# EAGLE schematic BeagleBone_Black_Wireless (EAGLE 7.4.0)
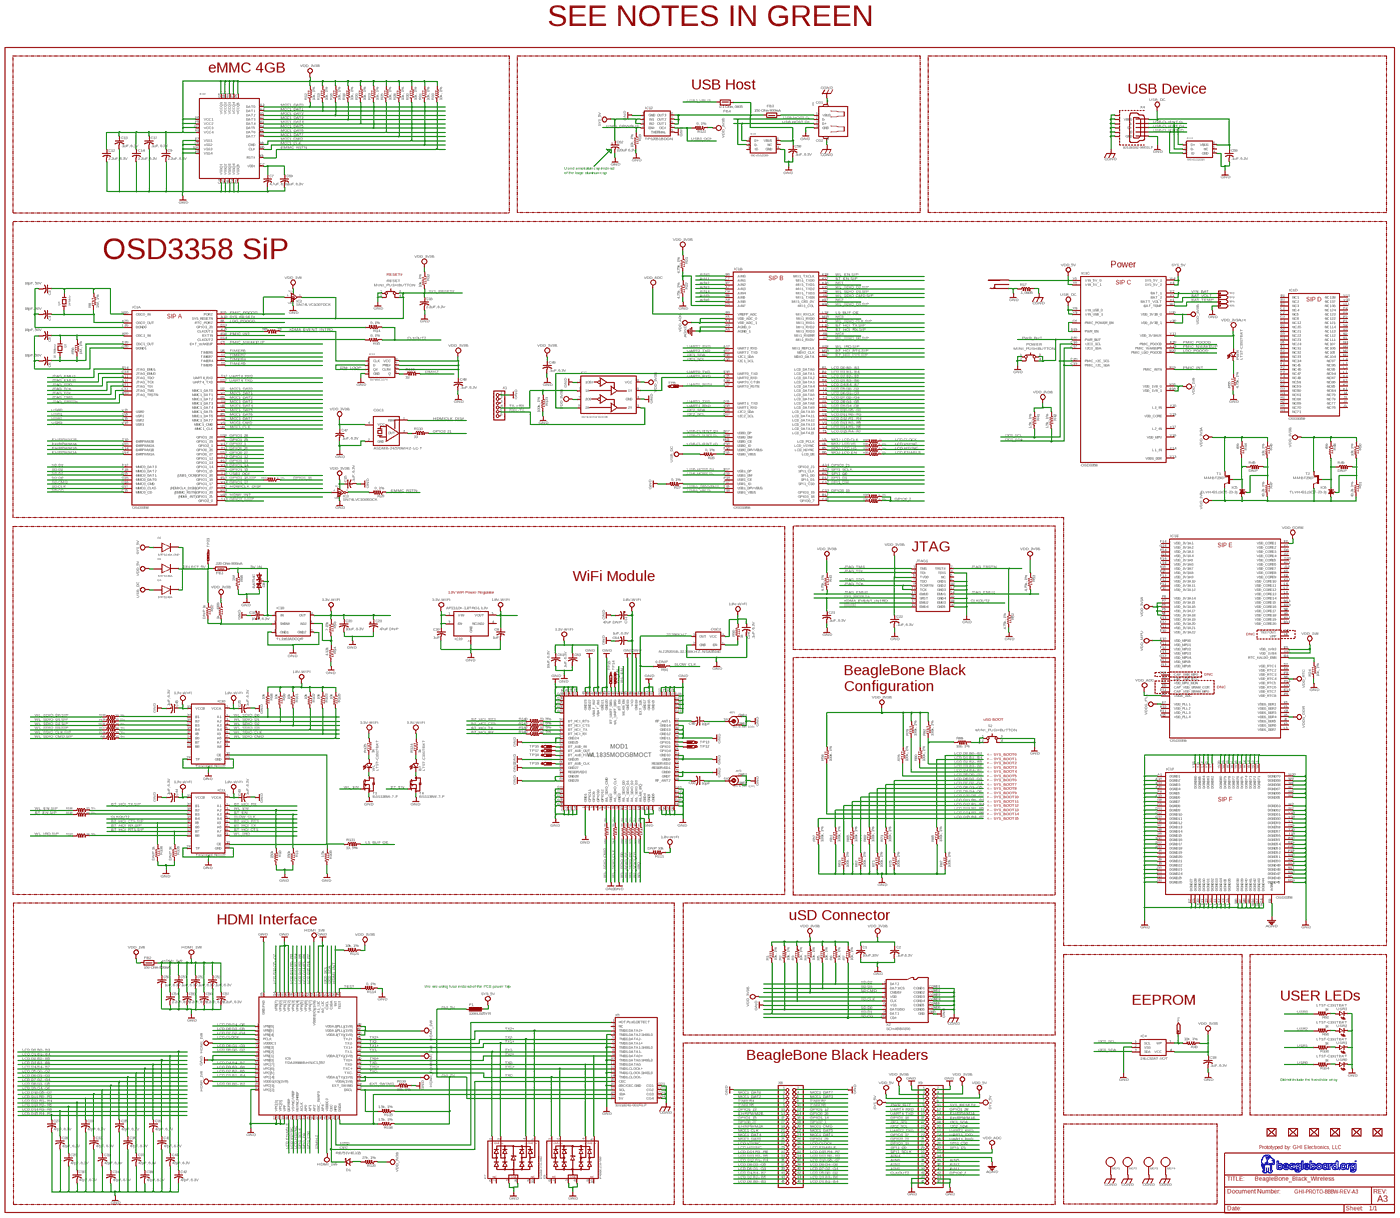
[diagram p0: schematic, sheet 1, overview]
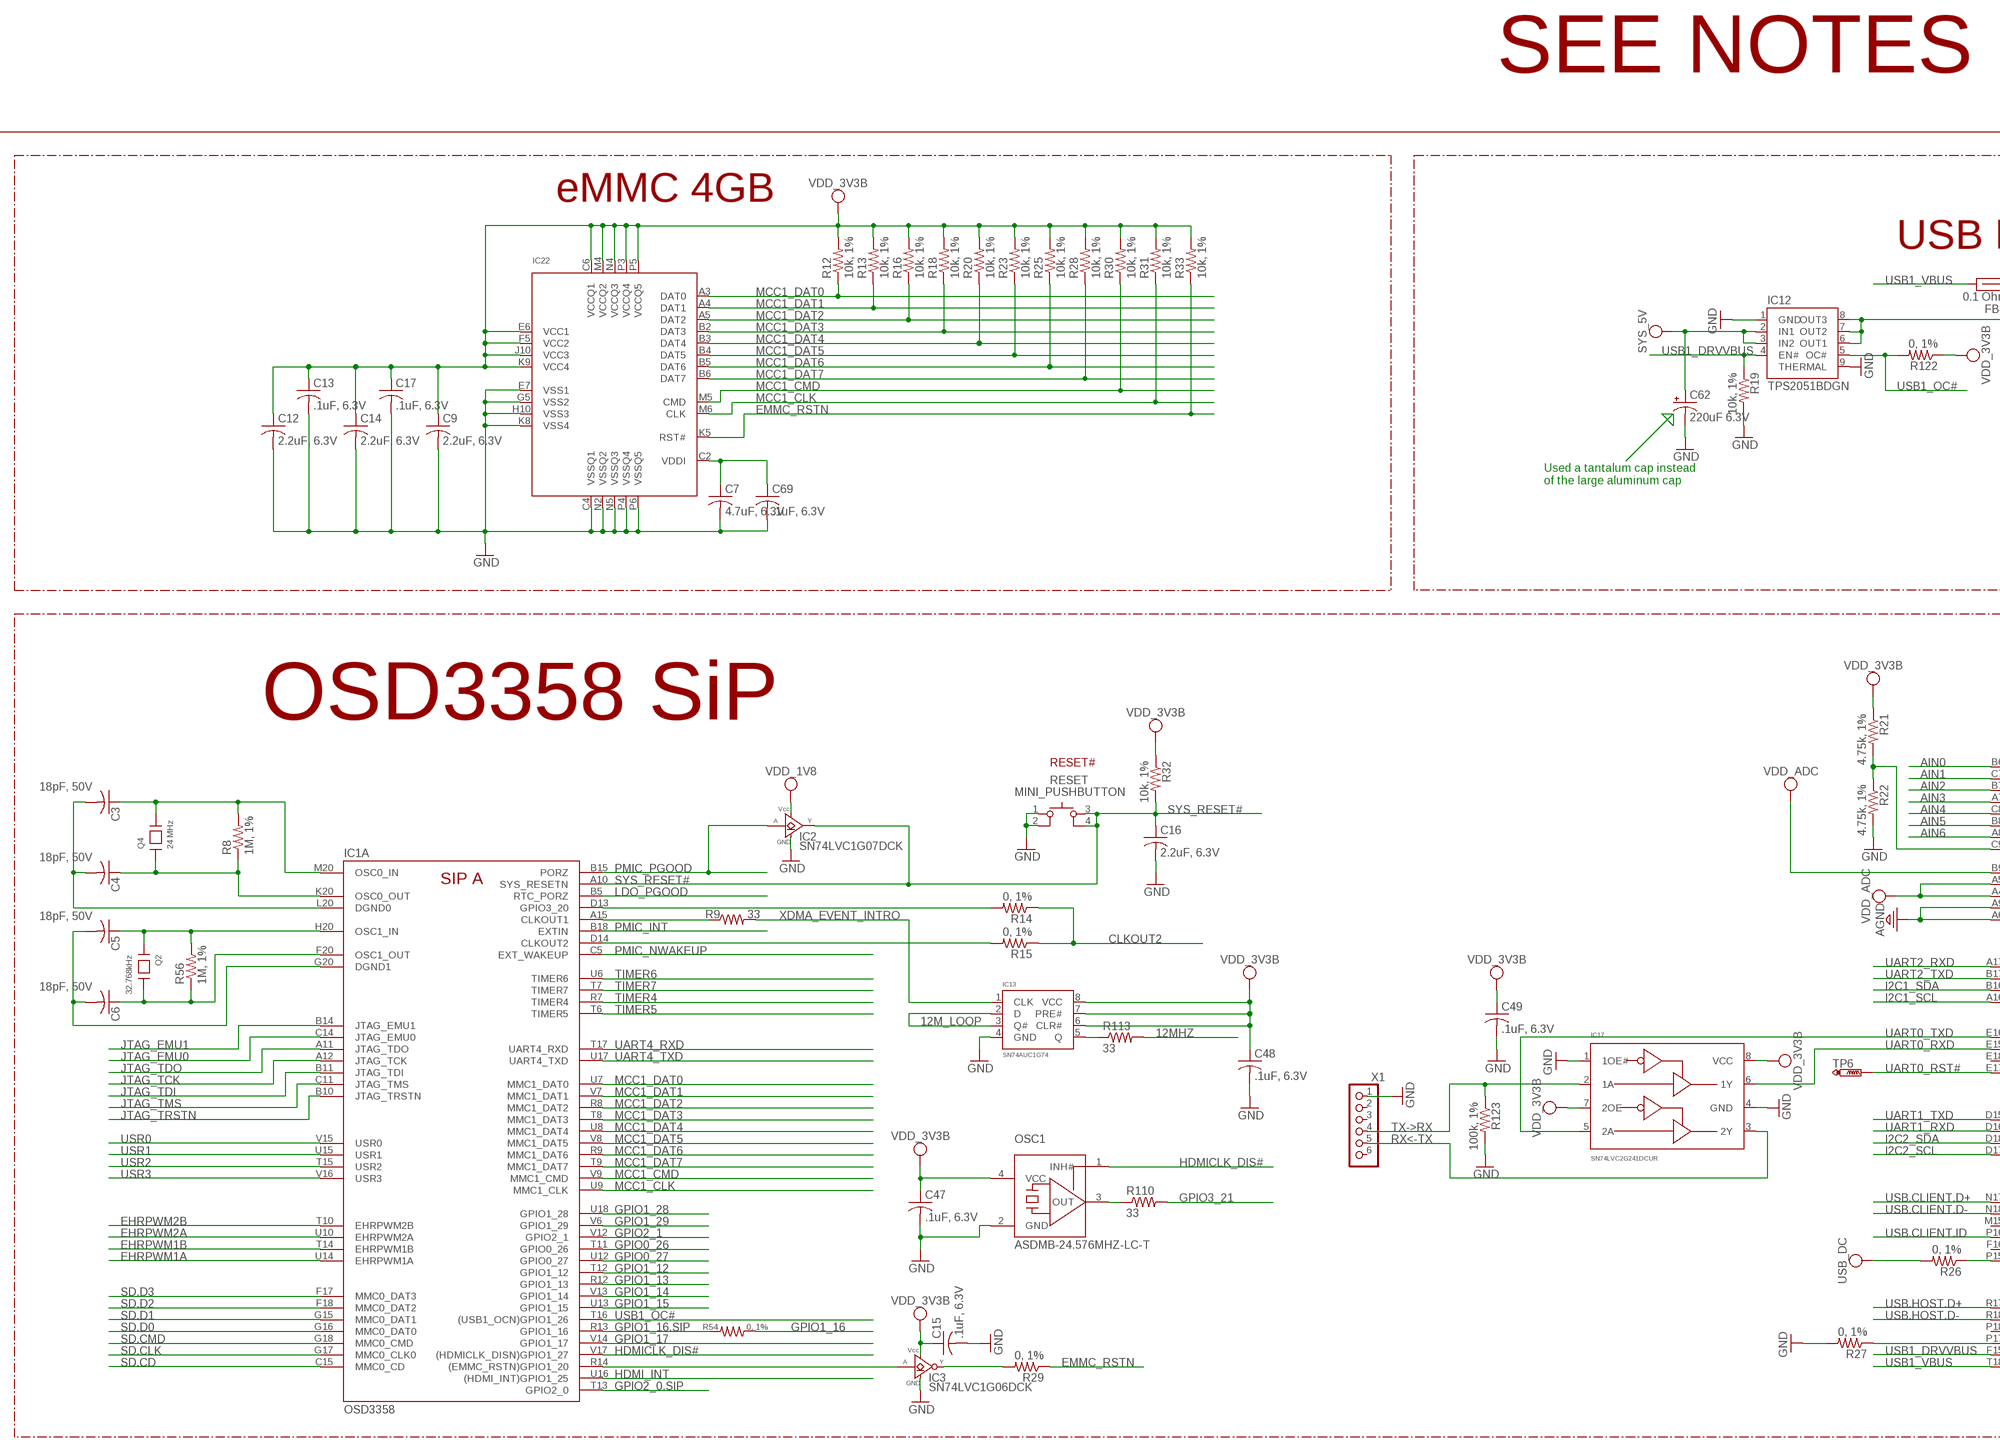
[diagram p1: schematic, sheet 1, part 1 of 4]
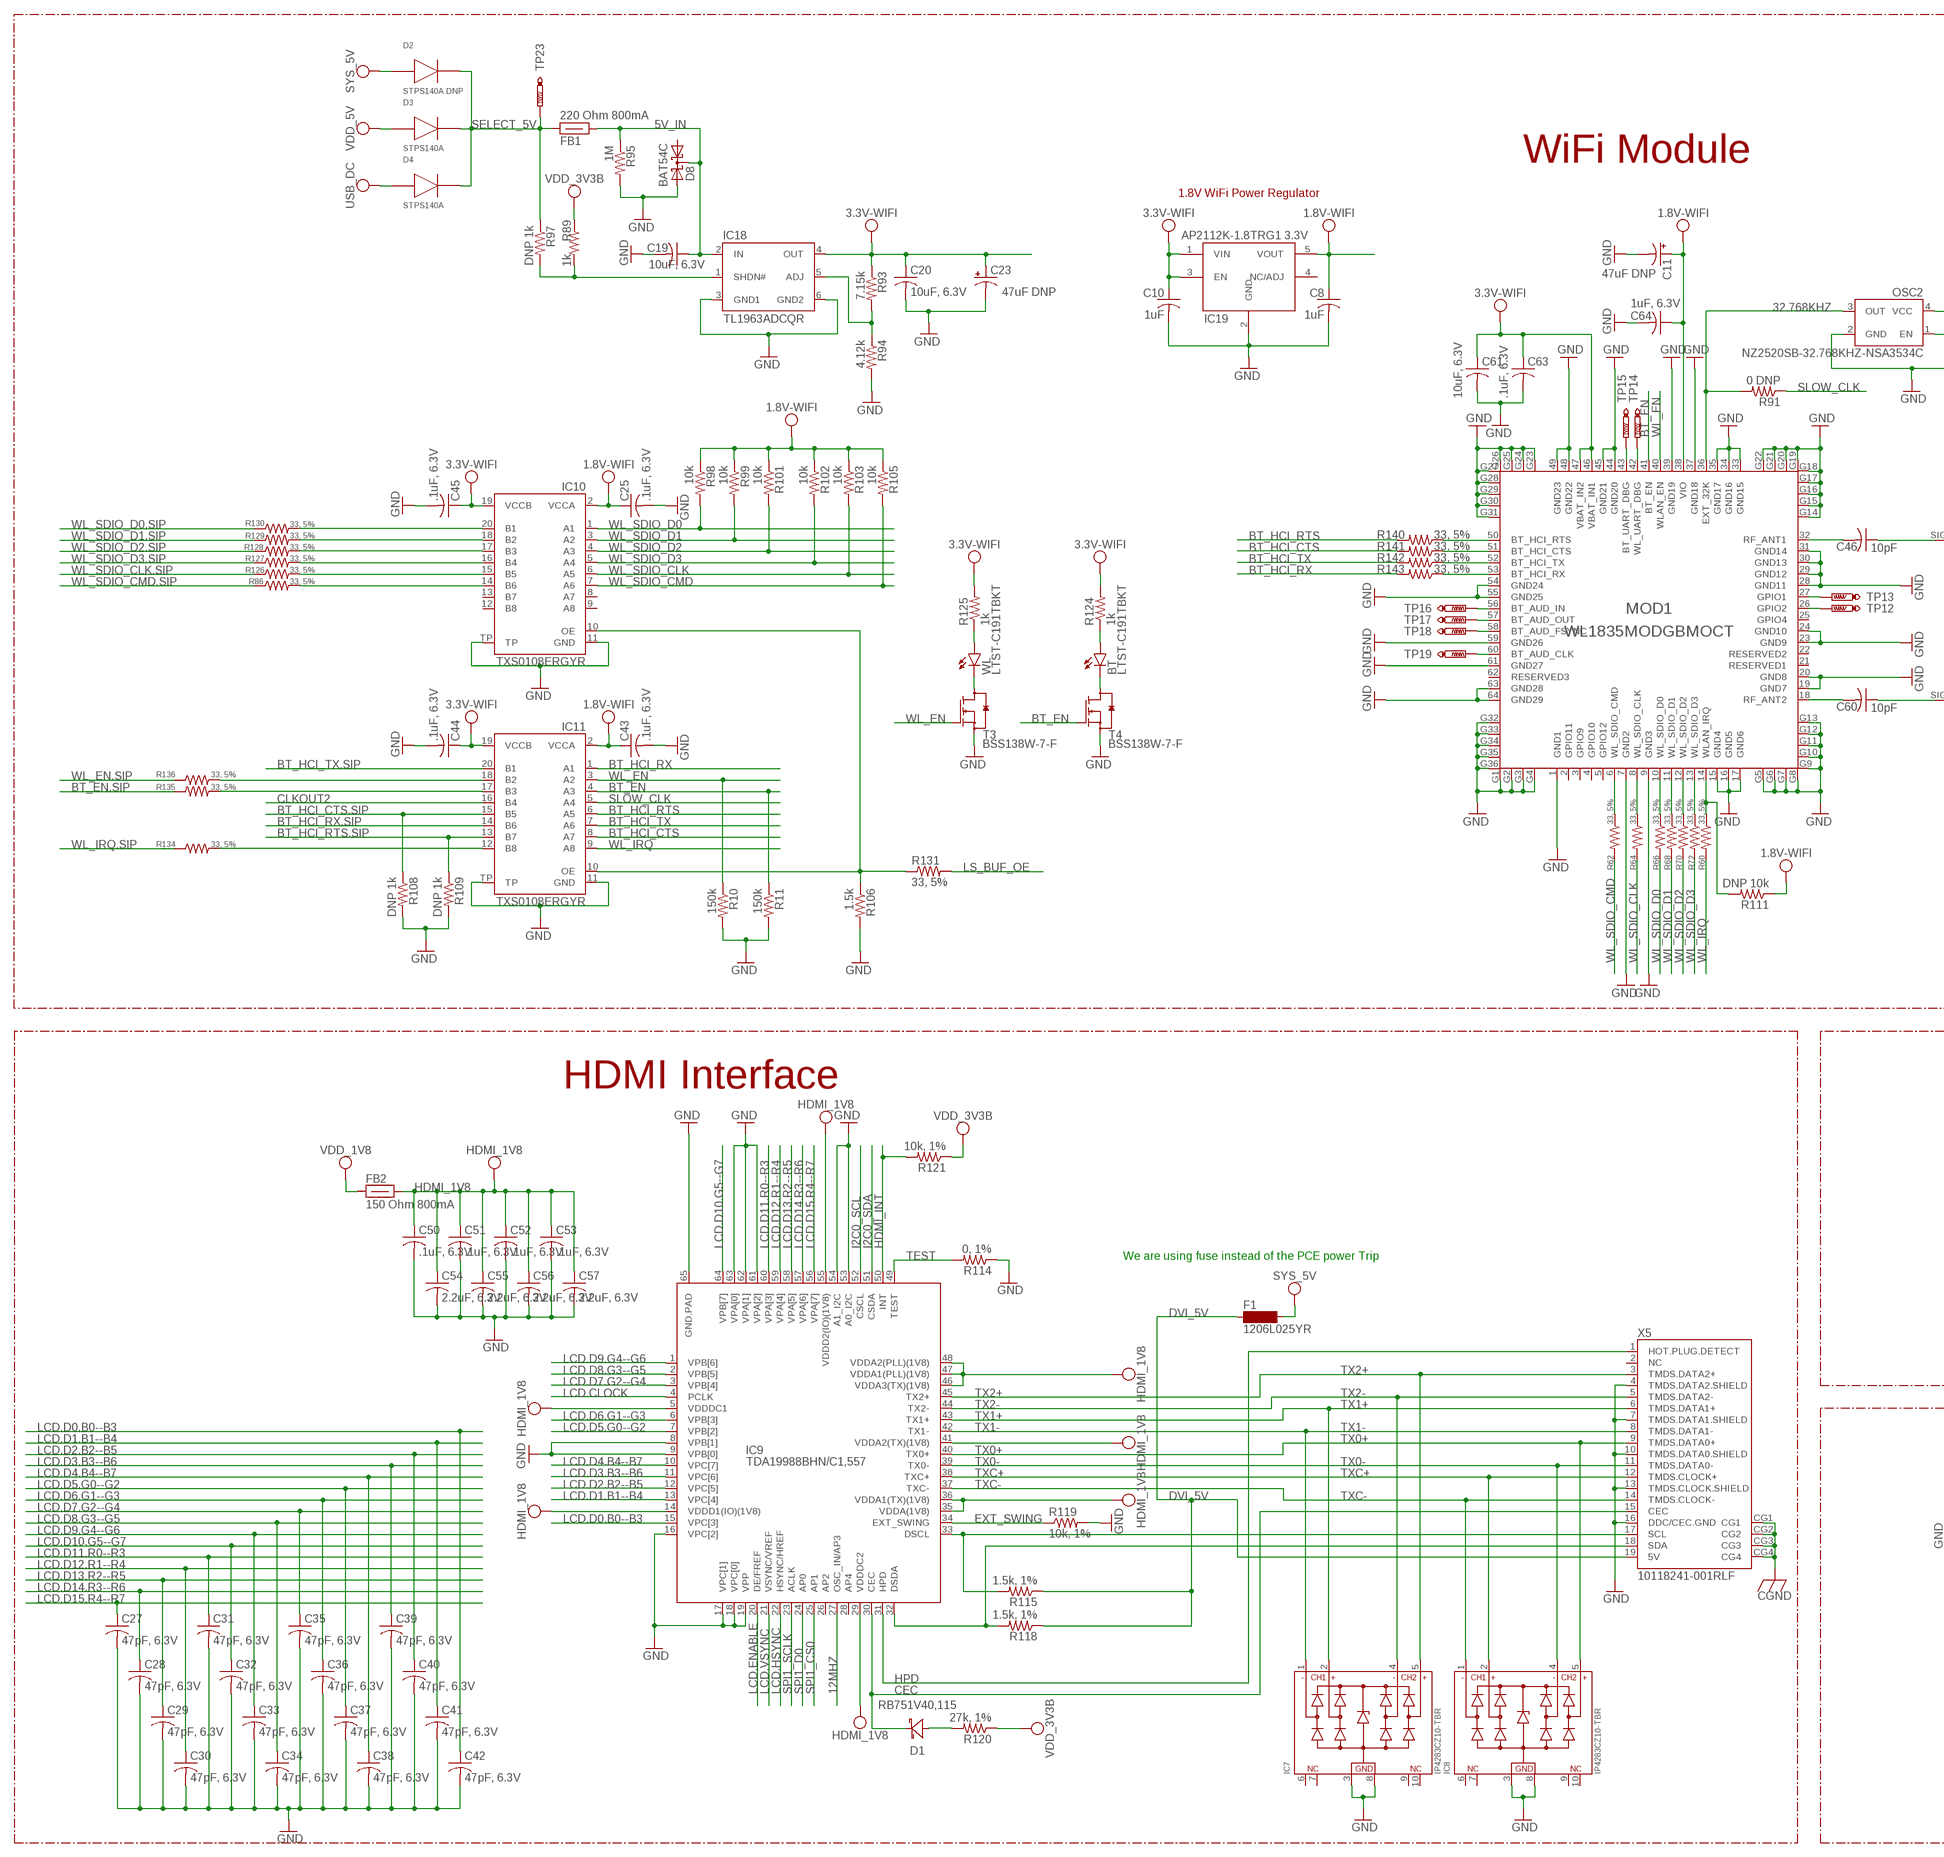
[diagram p2: schematic, sheet 1, part 2 of 4]
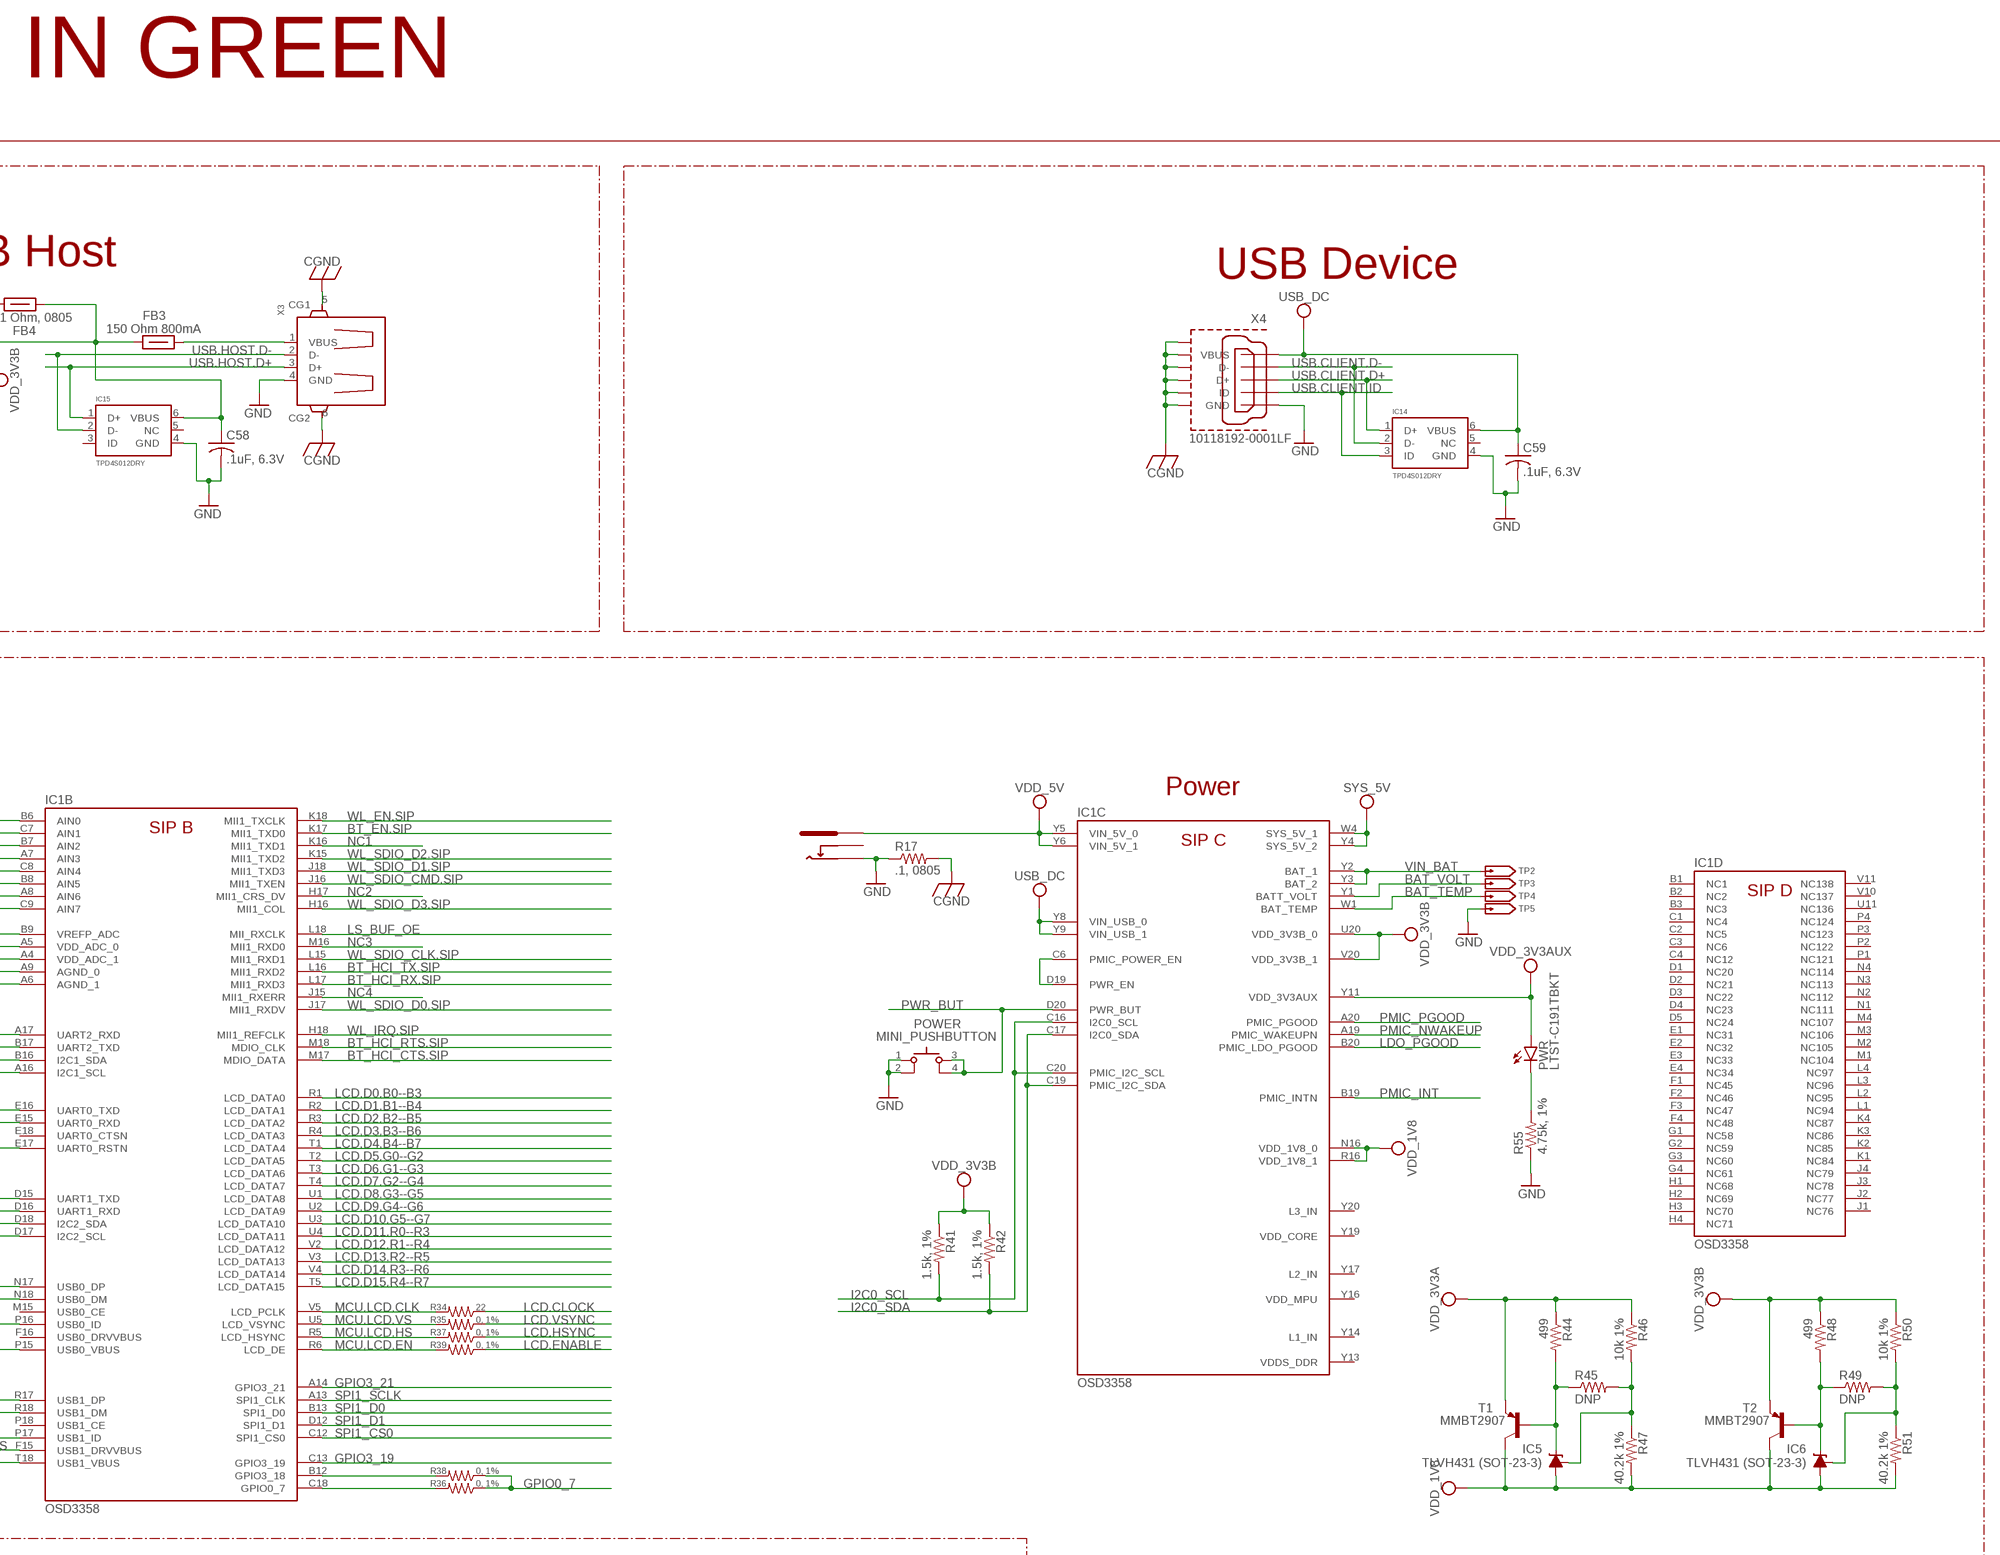
[diagram p3: schematic, sheet 1, part 3 of 4]
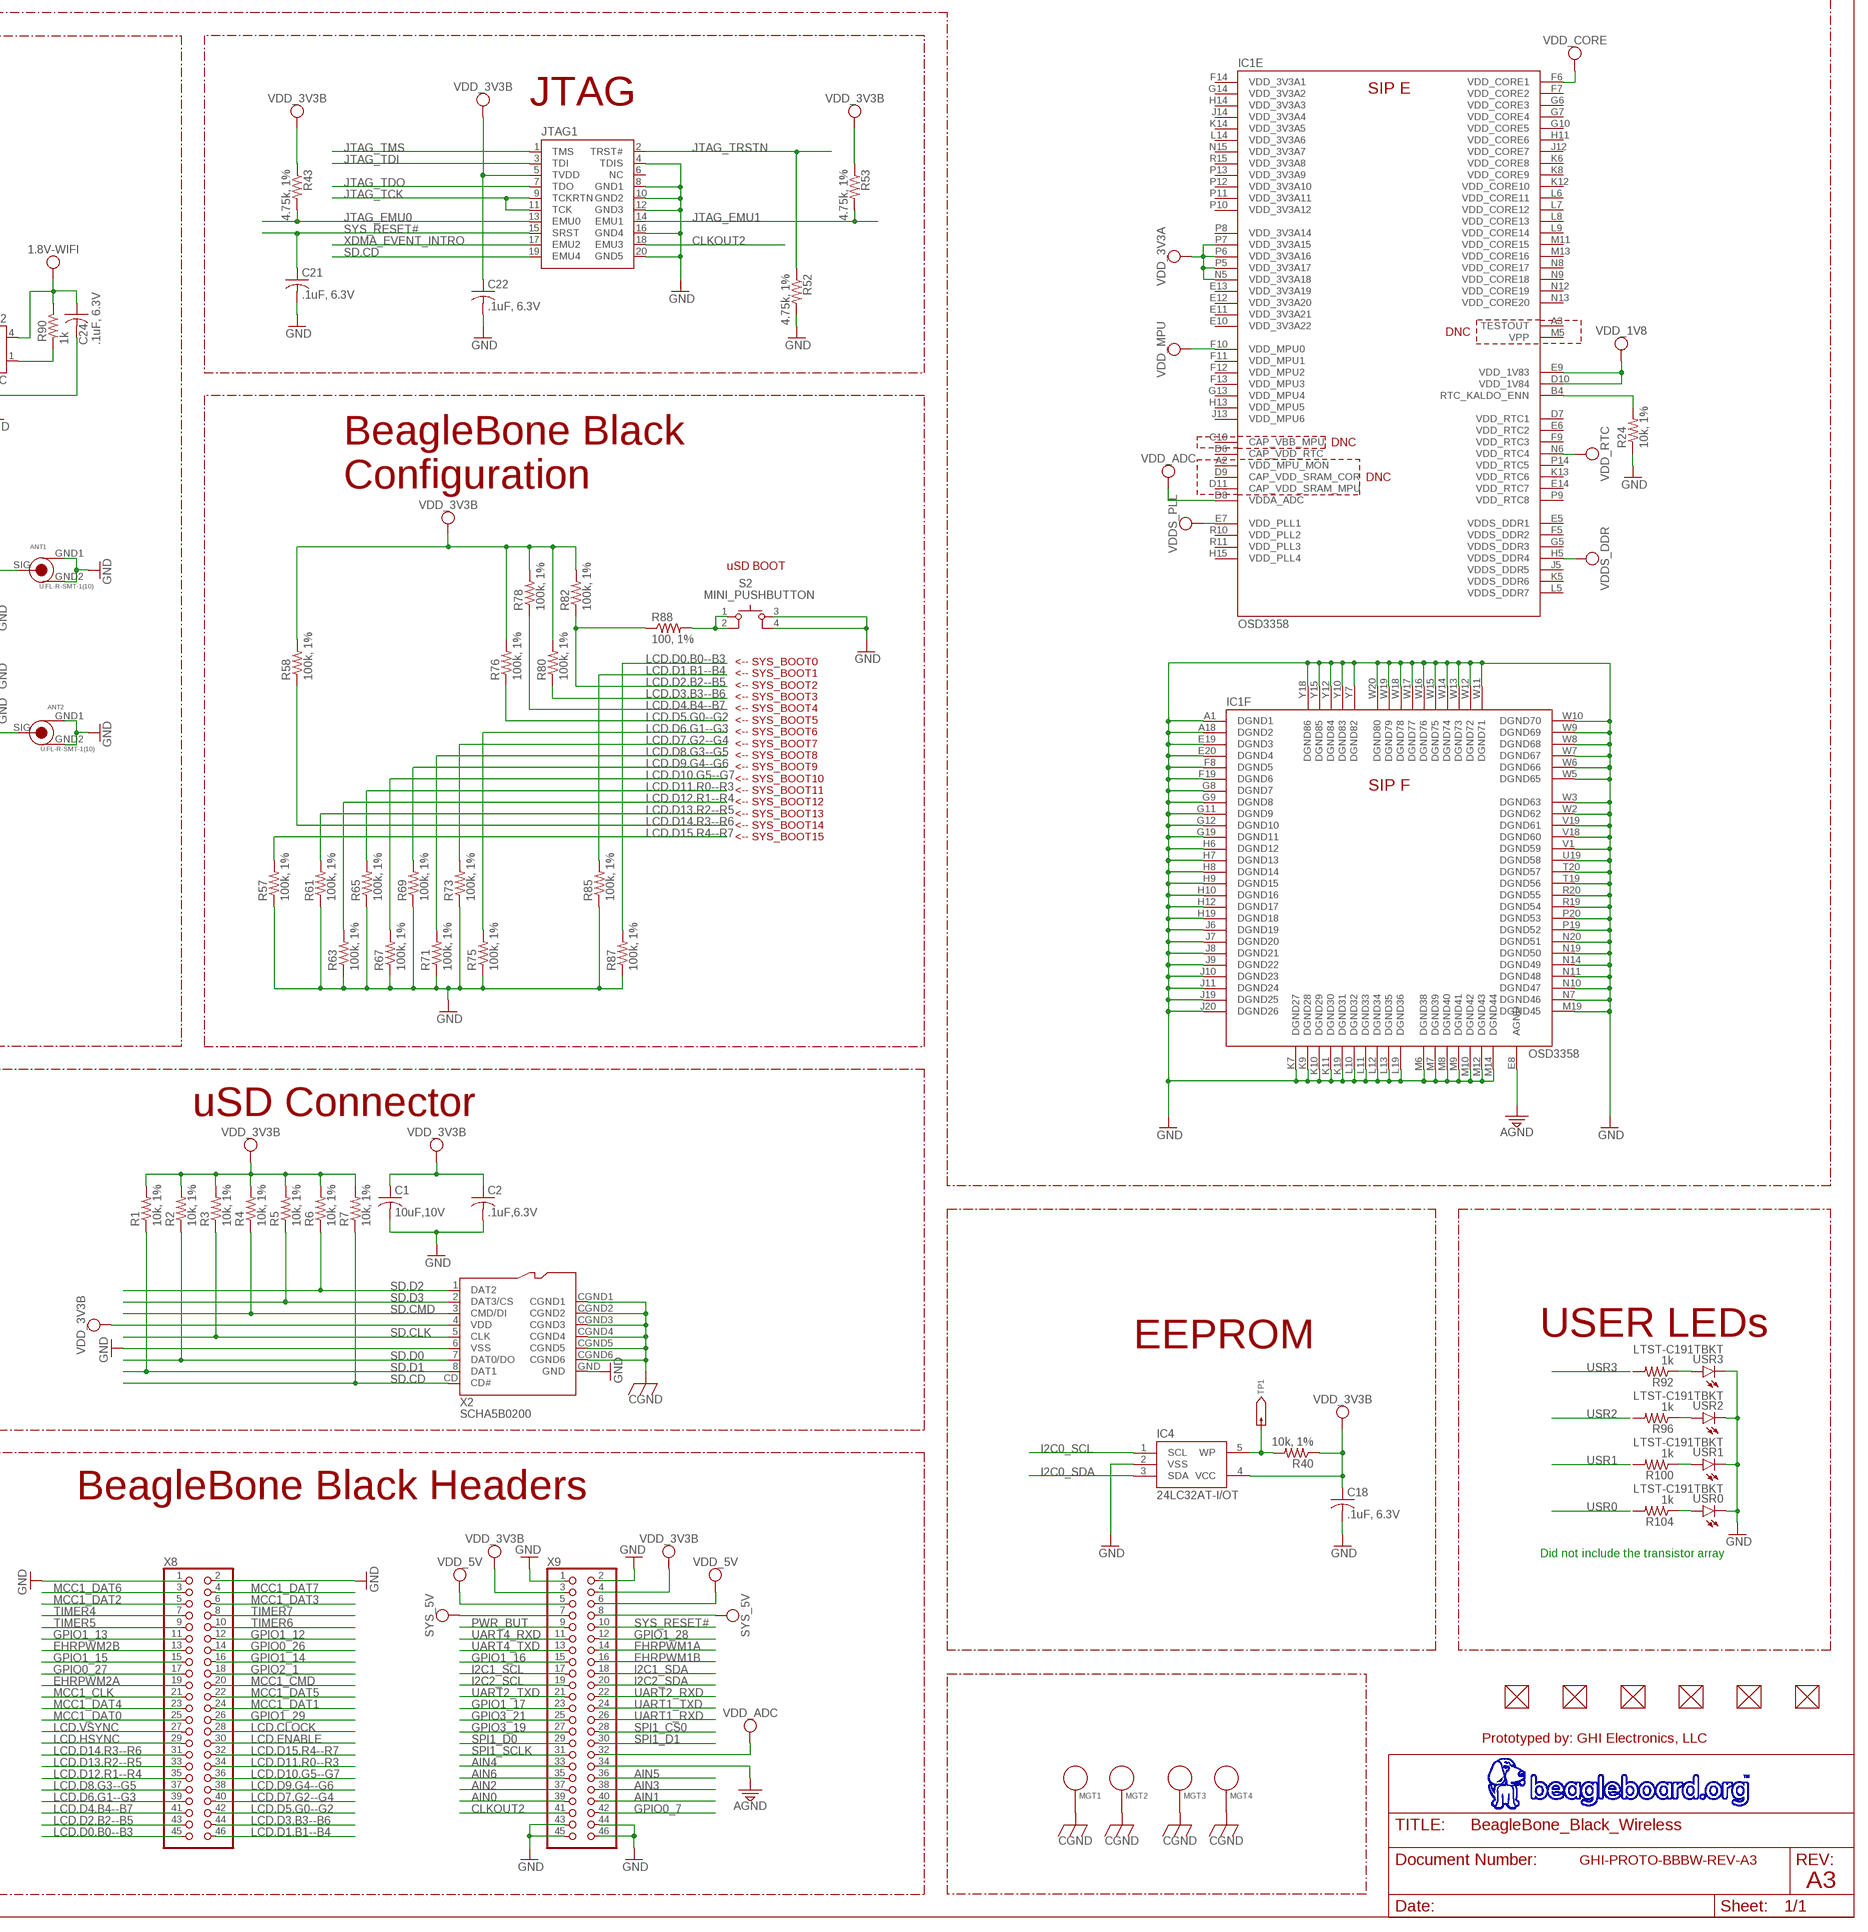
[diagram p4: schematic, sheet 1, part 4 of 4]

## Parts
ANT1  U.FL-R-SMT-1(10)  U.FL-R-SMT-1  [U.FL-R-SMT-1]
ANT2  U.FL-R-SMT-1(10)  U.FL-R-SMT-1  [U.FL-R-SMT-1]
BT  LTST-C191TBKT  LED-(INCH)-0603  [0603-LED]
C1  10uF,10V  C-USC0603K  [C0603K]
C2  .1uF,6.3V  C-USC0402K  [C0402K]
C3  18pF, 50V  C-USC0402K  [C0402K]
C4  18pF, 50V  C-USC0402K  [C0402K]
C5  18pF, 50V  C-USC0402K  [C0402K]
C6  18pF, 50V  C-USC0402K  [C0402K]
C7  4.7uF, 6.3V  C-USC0805K  [C0805K]
C8  1uF  C-USC0402K  [C0402K]
C9  2.2uF, 6.3V  C-USC0805K  [C0805K]
C10  1uF  C-USC0402K  [C0402K]
C11  47uF DNP  CPOL-USCT3528  [CT3528]
C12  2.2uF, 6.3V  C-USC0805K  [C0805K]
C13  .1uF, 6.3V  C-USC0402K  [C0402K]
C14  2.2uF, 6.3V  C-USC0805K  [C0805K]
C15  .1uF, 6.3V  C-USC0402K  [C0402K]
C16  2.2uF, 6.3V  C-USC0603K  [C0603K]
C17  .1uF, 6.3V  C-USC0402K  [C0402K]
C18  .1uF, 6.3V  C-USC0402K  [C0402K]
C19  10uF, 6.3V  C-USC0603K  [C0603K]
C20  10uF, 6.3V  C-USC0603K  [C0603K]
C21  .1uF, 6.3V  C-USC0402K  [C0402K]
C22  .1uF, 6.3V  C-USC0402K  [C0402K]
C23  47uF DNP  CPOL-USCT3528  [CT3528]
C24  .1uF, 6.3V  C-USC0402K  [C0402K]
C25  .1uF, 6.3V  C-USC0402K  [C0402K]
C27  47pF, 6.3V  C-USC0402K  [C0402K]
C28  47pF, 6.3V  C-USC0402K  [C0402K]
C29  47pF, 6.3V  C-USC0402K  [C0402K]
C30  47pF, 6.3V  C-USC0402K  [C0402K]
C31  47pF, 6.3V  C-USC0402K  [C0402K]
C32  47pF, 6.3V  C-USC0402K  [C0402K]
C33  47pF, 6.3V  C-USC0402K  [C0402K]
C34  47pF, 6.3V  C-USC0402K  [C0402K]
C35  47pF, 6.3V  C-USC0402K  [C0402K]
C36  47pF, 6.3V  C-USC0402K  [C0402K]
C37  47pF, 6.3V  C-USC0402K  [C0402K]
C38  47pF, 6.3V  C-USC0402K  [C0402K]
C39  47pF, 6.3V  C-USC0402K  [C0402K]
C40  47pF, 6.3V  C-USC0402K  [C0402K]
C41  47pF, 6.3V  C-USC0402K  [C0402K]
C42  47pF, 6.3V  C-USC0402K  [C0402K]
C43  .1uF, 6.3V  C-USC0402K  [C0402K]
C44  .1uF, 6.3V  C-USC0402K  [C0402K]
C45  .1uF, 6.3V  C-USC0402K  [C0402K]
C46  10pF  C-USC0402K  [C0402K]
C47  .1uF, 6.3V  C-USC0402K  [C0402K]
C48  .1uF, 6.3V  C-USC0402K  [C0402K]
C49  .1uF, 6.3V  C-USC0402K  [C0402K]
C50  .1uF, 6.3V  C-USC0402K  [C0402K]
C51  .1uF, 6.3V  C-USC0402K  [C0402K]
C52  .1uF, 6.3V  C-USC0402K  [C0402K]
C53  .1uF, 6.3V  C-USC0402K  [C0402K]
C54  2.2uF, 6.3V  C-USC0603K  [C0603K]
C55  2.2uF, 6.3V  C-USC0603K  [C0603K]
C56  2.2uF, 6.3V  C-USC0603K  [C0603K]
C57  2.2uF, 6.3V  C-USC0603K  [C0603K]
C58  .1uF, 6.3V  C-USC0402K  [C0402K]
C59  .1uF, 6.3V  C-USC0402K  [C0402K]
C60  10pF  C-USC0402K  [C0402K]
C61  10uF, 6.3V  C-USC0603K  [C0603K]
C62  220uF 6.3V  CPOL-USD/7343-31W  [D/7343-31W]
C63  .1uF, 6.3V  C-USC0402K  [C0402K]
C64  1uF, 6.3V  C-USC0402K  [C0402K]
C69  .1uF, 6.3V  C-USC0402K  [C0402K]
D1  RB751V40,115  DIODE-SCHOTTKY-(NXP)-SOD323-(REFLOW)  [SOD323(NXP)REFLOW]
D2  STPS140A DNP  DIODE_SMA  [DIODE_SMA]
D3  STPS140A  DIODE_SMA  [DIODE_SMA]
D4  STPS140A  DIODE_SMA  [DIODE_SMA]
D8  BAT54C  [SOT23]
F1  1206L025YR  SM-1206  [SM-1206]
FB1  220 Ohm 800mA  FB-(INCH)-0805  [0805-RESISTOR]
FB2  150 Ohm 800mA  FB-(INCH)-0805  [0805-RESISTOR]
FB3  150 Ohm 800mA  FB-(INCH)-0805  [0805-RESISTOR]
FB4  0.1 Ohm, 0805  FB-(INCH)-0805  [0805-RESISTOR]
FUD1  FIDUCIAL  [FIDUCIAL_40MIL]
FUD2  FIDUCIAL  [FIDUCIAL_40MIL]
FUD3  FIDUCIAL  [FIDUCIAL_40MIL]
FUD4  FIDUCIAL  [FIDUCIAL_40MIL]
FUD5  FIDUCIAL  [FIDUCIAL_40MIL]
FUD6  FIDUCIAL  [FIDUCIAL_40MIL]
IC1  OSD3358  SIP1000  [OSD3358]
IC2  SN74LVC1G07DCK  [SC70(TI-DCK)]
IC3  SN74LVC1G06DCK  [SC70(TI-DCK)]
IC4  24LC32AT-I/OT  24LC32A"  [SOT23-5(MICROCHIP)]
IC5  TLVH431 (SOT-23-3)  LM4041DIDBZ  [DBZ_R-PDSO-G3]
IC6  TLVH431 (SOT-23-3)  LM4041DIDBZ  [DBZ_R-PDSO-G3]
IC7  IP4283CZ10-TBR  IP4283CZ10IP4283CZ10-TBR  [SOT1176-1(NXP)]
IC8  IP4283CZ10-TBR  IP4283CZ10IP4283CZ10-TBR  [SOT1176-1(NXP)]
IC9  TDA19988BHN/C1,557  TDA19988BHN/C1  [SOT804-4(NXP)]
IC10  TXS0108ERGYR  [R-PVQFN-N20(TI)]
IC11  TXS0108ERGYR  [R-PVQFN-N20(TI)]
IC12  TPS2051BDGN  TPS2051B  [MSOP-POWER.PAD-8(TI)]
IC13  SN74AUC1G74  [SM8-8(TI)]
IC14  TPD4S012DRY  TPD4S012DRYR  [SON-6(TI)-DRY]
IC15  TPD4S012DRY  TPD4S012DRYR  [SON-6(TI)-DRY]
IC17  SN74LVC2G241DCUR  [VSSOP8(TI)]
IC18  TL1963ADCQR  TL1963A  [SOT-223(DCQ_R-PDSO-G6_TI)]
IC19  AP2112K-1.8TRG1 3.3V  5PIN_REG  [SOT23-5]
IC22  EMMC04G-S100-B08U  [MICRON_EMMC_153]
JTAG1  JTAG  [JTAG]
MGT1  MOUNTING_HOLE  [MOUNTING_HOLE]
MGT2  MOUNTING_HOLE  [MOUNTING_HOLE]
MGT3  MOUNTING_HOLE  [MOUNTING_HOLE]
MGT4  MOUNTING_HOLE  [MOUNTING_HOLE]
MOD1  WL1835MODGBMOCT  WL1835MOD  [MOC-100(TI)]
OSC1  ASDMB-24.576MHZ-LC-T  OSC-2.5X2.0  [OSCILLATOR-2.5X2.0-BBB]
OSC2  NZ2520SB-32.768KHZ-NSA3534C  OSCILLATOR  [NZ2520S]
POWER  MINI_PUSHBUTTON  [MINI_PUSHBUTTON]
PWR  LTST-C191TBKT  LED-(INCH)-0603  [0603-LED]
Q2  32.768kHz  CRYSTAL_3.2X1.5  [CRYSTAL_3.2X1.5]
Q4  24 MHz  CRYSTAL_5X3.2MM  [CRYSTAL_5X3.2MM]
R1  10k, 1%  R-US_R0402  [R0402]
R2  10k, 1%  R-US_R0402  [R0402]
R3  10k, 1%  R-US_R0402  [R0402]
R4  10k, 1%  R-US_R0402  [R0402]
R5  10k, 1%  R-US_R0402  [R0402]
R6  10k, 1%  R-US_R0402  [R0402]
R7  10k, 1%  R-US_R0402  [R0402]
R8  1M, 1%  R-US_R0402  [R0402]
R9  33  R-US_R0402  [R0402]
R10  150k  R-US_R0402  [R0402]
R11  150k  R-US_R0402  [R0402]
R12  10k, 1%  R-US_R0402  [R0402]
R13  10k, 1%  R-US_R0402  [R0402]
R14  0, 1%  R-US_R0402  [R0402]
R15  0, 1%  R-US_R0402  [R0402]
R16  10k, 1%  R-US_R0402  [R0402]
R17  .1, 0805  R-US_R0805  [R0805]
R18  10k, 1%  R-US_R0402  [R0402]
R19  10k, 1%  R-US_R0402  [R0402]
R20  10k, 1%  R-US_R0402  [R0402]
R21  4.75k, 1%  R-US_R0402  [R0402]
R22  4.75k, 1%  R-US_R0402  [R0402]
R23  10k, 1%  R-US_R0402  [R0402]
R24  10k, 1%  R-US_R0402  [R0402]
R25  10k, 1%  R-US_R0402  [R0402]
R26  0, 1%  R-US_R0402  [R0402]
R27  0, 1%  R-US_R0402  [R0402]
R28  10k, 1%  R-US_R0402  [R0402]
R29  0, 1%  R-US_R0402  [R0402]
R30  10k, 1%  R-US_R0402  [R0402]
R31  10k, 1%  R-US_R0402  [R0402]
R32  10k, 1%  R-US_R0402  [R0402]
R33  10k, 1%  R-US_R0402  [R0402]
R34  22  R-US_R0402  [R0402]
R35  0, 1%  R-US_R0402  [R0402]
R36  0, 1%  R-US_R0402  [R0402]
R37  0, 1%  R-US_R0402  [R0402]
R38  0, 1%  R-US_R0402  [R0402]
R39  0, 1%  R-US_R0402  [R0402]
R40  10k, 1%  R-US_R0402  [R0402]
R41  1.5k, 1%  R-US_R0402  [R0402]
R42  1.5k, 1%  R-US_R0402  [R0402]
R43  4.75k, 1%  R-US_R0402  [R0402]
R44  499  R-US_R0402  [R0402]
R45  DNP  R-US_R0402  [R0402]
R46  10k 1%  R-US_R0402  [R0402]
R47  40.2k 1%  R-US_R0402  [R0402]
R48  499  R-US_R0402  [R0402]
R49  DNP  R-US_R0402  [R0402]
R50  10k 1%  R-US_R0402  [R0402]
R51  40.2k 1%  R-US_R0402  [R0402]
R52  4.75k, 1%  R-US_R0402  [R0402]
R53  4.75k, 1%  R-US_R0402  [R0402]
R54  0, 1%  R-US_R0402  [R0402]
R55  4.75k, 1%  R-US_R0402  [R0402]
R56  1M, 1%  R-US_R0402  [R0402]
R57  100k, 1%  R-US_R0402  [R0402]
R58  100k, 1%  R-US_R0402  [R0402]
R60  33, 5%  R-US_R0402  [R0402]
R61  100k, 1%  R-US_R0402  [R0402]
R62  33, 5%  R-US_R0402  [R0402]
R63  100k, 1%  R-US_R0402  [R0402]
R64  33, 5%  R-US_R0402  [R0402]
R65  100k, 1%  R-US_R0402  [R0402]
R66  33, 5%  R-US_R0402  [R0402]
R67  100k, 1%  R-US_R0402  [R0402]
R68  33, 5%  R-US_R0402  [R0402]
R69  100k, 1%  R-US_R0402  [R0402]
R70  33, 5%  R-US_R0402  [R0402]
R71  100k, 1%  R-US_R0402  [R0402]
R72  33, 5%  R-US_R0402  [R0402]
R73  100k, 1%  R-US_R0402  [R0402]
R75  100k, 1%  R-US_R0402  [R0402]
R76  100k, 1%  R-US_R0402  [R0402]
R78  100k, 1%  R-US_R0402  [R0402]
R80  100k, 1%  R-US_R0402  [R0402]
R82  100k, 1%  R-US_R0402  [R0402]
R85  100k, 1%  R-US_R0402  [R0402]
R86  33, 5%  R-US_R0603  [R0603]
R87  100k, 1%  R-US_R0402  [R0402]
R88  100, 1%  R-US_R0402  [R0402]
R89  1k  R-US_R0402  [R0402]
R90  1k  R-US_R0402  [R0402]
R91  0 DNP  R-US_R0402  [R0402]
R92  1k  R-US_R0402  [R0402]
R93  7.15k  R-US_R0402  [R0402]
R94  4.12k  R-US_R0402  [R0402]
R95  1M  R-US_R0402  [R0402]
R96  1k  R-US_R0402  [R0402]
R97  DNP 1k  R-US_R0402  [R0402]
R98  10k  R-US_R0402  [R0402]
R99  10k  R-US_R0402  [R0402]
R100  1k  R-US_R0402  [R0402]
R101  10k  R-US_R0402  [R0402]
R102  10k  R-US_R0402  [R0402]
R103  10k  R-US_R0402  [R0402]
R104  1k  R-US_R0402  [R0402]
R105  10k  R-US_R0402  [R0402]
R106  1.5k  R-US_R0402  [R0402]
R108  DNP 1k  R-US_R0402  [R0402]
R109  DNP 1k  R-US_R0402  [R0402]
R110  33  R-US_R0402  [R0402]
R111  DNP 10k  R-US_R0402  [R0402]
R113  33  R-US_R0402  [R0402]
R114  0, 1%  R-US_R0402  [R0402]
R115  1.5k, 1%  R-US_R0402  [R0402]
R118  1.5k, 1%  R-US_R0402  [R0402]
R119  10k, 1%  R-US_R0402  [R0402]
R120  27k, 1%  R-US_R0402  [R0402]
R121  10k, 1%  R-US_R0402  [R0402]
R122  0, 1%  R-US_R0402  [R0402]
R123  100k, 1%  R-US_R0402  [R0402]
R124  1k  R-US_R0402  [R0402]
R125  1k  R-US_R0402  [R0402]
R126  33, 5%  R-US_R0603  [R0603]
R127  33, 5%  R-US_R0603  [R0603]
R128  33, 5%  R-US_R0603  [R0603]
R129  33, 5%  R-US_R0603  [R0603]
R130  33, 5%  R-US_R0603  [R0603]
R131  33, 5%  R-US_R0603  [R0603]
R134  33, 5%  R-US_R0603  [R0603]
R135  33, 5%  R-US_R0603  [R0603]
R136  33, 5%  R-US_R0603  [R0603]
R140  33, 5%  R-US_R0402  [R0402]
R141  33, 5%  R-US_R0402  [R0402]
R142  33, 5%  R-US_R0402  [R0402]
R143  33, 5%  R-US_R0402  [R0402]
RESET  MINI_PUSHBUTTON  [MINI_PUSHBUTTON]
S2  MINI_PUSHBUTTON  [MINI_PUSHBUTTON]
T1  MMBT2907  MMBT2907ALT1SMD  [SOT23-BEC]
T2  MMBT2907  MMBT2907ALT1SMD  [SOT23-BEC]
T3  BSS138W-7-F  [SOT-323(DIODES)]
T4  BSS138W-7-F  [SOT-323(DIODES)]
TP1  TESTPAD/W_HOLE_1X1  [TESTPAD/W_HOLE_1X1]
TP2  TESTPAD/W_HOLE_1X1  [TESTPAD/W_HOLE_1X1]
TP3  TESTPAD/W_HOLE_1X1  [TESTPAD/W_HOLE_1X1]
TP4  TESTPAD/W_HOLE_1X1  [TESTPAD/W_HOLE_1X1]
TP5  TESTPAD/W_HOLE_1X1  [TESTPAD/W_HOLE_1X1]
TP6  PTR1B1,27  [B1,27]
TP12  PTR1B1,27  [B1,27]
TP13  PTR1B1,27  [B1,27]
TP14  PTR1B1,27  [B1,27]
TP15  PTR1B1,27  [B1,27]
TP16  PTR1B1,27  [B1,27]
TP17  PTR1B1,27  [B1,27]
TP18  PTR1B1,27  [B1,27]
TP19  PTR1B1,27  [B1,27]
TP23  PTR1B1,27  [B1,27]
USR0  LTST-C191TBKT  LED-(INCH)-0603  [0603-LED]
USR1  LTST-C191TBKT  LED-(INCH)-0603  [0603-LED]
USR2  LTST-C191TBKT  LED-(INCH)-0603  [0603-LED]
USR3  LTST-C191TBKT  LED-(INCH)-0603  [0603-LED]
WL  LTST-C191TBKT  LED-(INCH)-0603  [0603-LED]
X1  1X6-(INCH)-0.1-TH  [TH-1X6]
X2  SCHA5B0200  SCHA5B0200(ALPS_USD)  [SCHA5B0200]
X3  USB_HOST_W/CHASSIS_GND  [USB_HOST_HORIZONTAL_W/CHASSIS_GND]
X4  10118192-0001LF  [10118192-0001LF(MICRO-USB-B-AMPHENOL-FCI)]
X5  10118241-001RLF  HDMI-TYPE-D-10118241  [HDMI-TYPE-D-10118241]
X8  HEADER-2X23-(INCH)-0.1-TH  [TH-2X23]
X9  HEADER-2X23-(INCH)-0.1-TH  [TH-2X23]
X12  PJ-102B_POWER_CON  [PJ-102B_POWER_CON]

## Nets
1.8V-WIFI: C8.1 C11.+ C24.1 C25.1 C43.1 C64.1 IC10.2(VCCA) IC11.2(VCCA) IC19.5(VOUT) MOD1.38(VIO) OSC2.4(VCC) R90.1 R98.1 R99.1 R101.1 R102.1 R103.1 R105.1 R111.1
3.3V-WIFI: C10.1 C20.1 C23.+ C44.1 C45.1 C61.1 C63.1 IC10.19(VCCB) IC11.19(VCCB) IC18.4(OUT) IC19.1(VIN) IC19.3(EN) MOD1.46(VBAT_IN1) MOD1.47(VBAT_IN2) R93.1 R124.2 R125.2
5V_IN: C19.1 D8.3(CC) FB1.2 IC18.2(IN) R95.1
12M_LOOP: IC13.2(D) IC13.3(Q#)
12MHZ: IC9.27(OSC_IN/AP3) R113.2
32.768KHZ: MOD1.36(EXT_32K) OSC2.3(OUT) R91.2
AGND [power]: IC1.A6(B:AGND_1) IC1.A9(B:AGND_0) IC1.E8(F:AGND) X9.34
AIN0: IC1.B6(B:AIN0) X9.39
AIN1: IC1.C7(B:AIN1) X9.40
AIN2: IC1.B7(B:AIN2) X9.37
AIN3: IC1.A7(B:AIN3) X9.38
AIN4: IC1.C8(B:AIN4) X9.33
AIN5: IC1.B8(B:AIN5) X9.36
AIN6: IC1.A8(B:AIN6) X9.35
AIN7: IC1.C9(B:AIN7) R21.2 R22.1
ALT.BT.EN: IC11.17(B3) R135.2
ALT.BUFF.OE: IC10.10(OE) IC11.10(OE) R106.1 R131.1
ALT.WL.CLK: IC10.15(B5) R126.2
ALT.WL.CMD: IC10.14(B6) R86.2
ALT.WL.D0: IC10.20(B1) R130.2
ALT.WL.D1: IC10.18(B2) R129.2
ALT.WL.D2: IC10.17(B3) R128.2
ALT.WL.D3: IC10.16(B4) R127.2
ALT.WL.EN: IC11.18(B2) R136.2
ALT.WL.IRQ: IC11.12(B8) R134.2
BAT_TEMP: IC1.W1(C:BAT_TEMP) TP4.P$1(TP)
BAT_VOLT: IC1.Y1(C:BATT_VOLT) TP3.P$1(TP)
BT_EN: IC11.4(A3) MOD1.41(BT_EN) R11.1 T4.G
BT_EN.SIP: IC1.K17(B:MII1_TXD0) R135.1
BT_HCI_CTS: IC11.8(A7) R141.2
BT_HCI_CTS.SIP: IC1.M17(B:MDIO_DATA) IC11.15(B5) R108.1
BT_HCI_RTS: IC11.6(A5) R140.2
BT_HCI_RTS.SIP: IC1.M18(B:MDIO_CLK) IC11.13(B7) R109.1
BT_HCI_RX: IC11.1(A1) R143.2
BT_HCI_RX.SIP: IC1.L17(B:MII1_RXD3) IC11.14(B6)
BT_HCI_TX: IC11.7(A6) R142.2
BT_HCI_TX.SIP: IC1.L16(B:MII1_RXD2) IC11.20(B1)
CEC: D1.C(CATHODE) IC9.30(CEC) X5.15(CEC)
CGND: MGT1.P$1 MGT2.P$1 MGT3.P$1 MGT4.P$1 R17.2 X2.CGND1 X2.CGND2 X2.CGND3 X2.CGND4 X2.CGND5 X2.CGND6 X3.5(CG1) X3.6(CG2) X4.CGND1(SGND1) X4.CGND2(SGND2) X4.CGND3(SGND3) X4.CGND4(SGND4) X4.CGND5(SGND5) X4.CGND6(SGND6) X5.CG1 X5.CG2 X5.CG3 X5.CG4
CLKOUT2: IC11.16(B4) JTAG1.18(EMU3) R14.1 R15.1 X9.41
DVI_5V: F1.1 R115.1 R118.1 X5.19(5V)
EHRPWM1A: IC1.U14(A:EHRPWM1A) X9.14
EHRPWM1B: IC1.T14(A:EHRPWM1B) X9.16
EHRPWM2A: IC1.U10(A:EHRPWM2A) X8.19
EHRPWM2B: IC1.T10(A:EHRPWM2B) X8.13
EMMC_RSTN: IC22.K5(RST#) R29.1 R33.1
EXT_SWING: IC9.34(EXT_SWING) R119.1
GND [power]: ANT1.GND1 ANT1.GND2 ANT2.GND1 ANT2.GND2 C1.2 C2.2 C7.2 C8.2 C9.2 C10.2 C11.- C12.2 C13.2 C14.2 C15.2 C16.2 C17.2 C18.2 C19.2 C20.2 C21.2 C22.2 C23.- C24.2 C25.2 C27.2 C28.2 C29.2 C30.2 C31.2 C32.2 C33.2 C34.2 C35.2 C36.2 C37.2 C38.2 C39.2 C40.2 C41.2 C42.2 C43.2 C44.2 C45.2 C47.2 C48.2 C49.2 C50.2 C51.2 C52.2 C53.2 C54.2 C55.2 C56.2 C57.2 C58.2 C59.2 C61.2 C62.- C63.2 C64.2 C69.2 D8.2(A2) IC1.A1(F:DGND1) IC1.A18(F:DGND2) IC1.E19(F:DGND3) IC1.E20(F:DGND4) IC1.F8(F:DGND5) IC1.F19(F:DGND6) IC1.G8(F:DGND7) IC1.G9(F:DGND8) IC1.G11(F:DGND9) IC1.G12(F:DGND10) IC1.G19(F:DGND11) IC1.H6(F:DGND12) IC1.H7(F:DGND13) IC1.H8(F:DGND14) IC1.H9(F:DGND15) IC1.H10(F:DGND16) IC1.H12(F:DGND17) IC1.H19(F:DGND18) IC1.J6(F:DGND19) IC1.J7(F:DGND20) IC1.J8(F:DGND21) IC1.J9(F:DGND22) IC1.J10(F:DGND23) IC1.J11(F:DGND24) IC1.J19(F:DGND25) IC1.J20(F:DGND26) IC1.K7(F:DGND27) IC1.K9(F:DGND28) IC1.K10(F:DGND29) IC1.K11(F:DGND30) IC1.K19(F:DGND31) IC1.L10(F:DGND32) IC1.L11(F:DGND33) IC1.L12(F:DGND34) IC1.L13(F:DGND35) IC1.L19(F:DGND36) IC1.M6(F:DGND38) IC1.M7(F:DGND39) IC1.M8(F:DGND40) IC1.M9(F:DGND41) IC1.M10(F:DGND42) IC1.M12(F:DGND43) IC1.M14(F:DGND44) IC1.M19(F:DGND45) IC1.N7(F:DGND46) IC1.N10(F:DGND47) IC1.N11(F:DGND48) IC1.N14(F:DGND49) IC1.N19(F:DGND50) IC1.N20(F:DGND51) IC1.P19(F:DGND52) IC1.P20(F:DGND53) IC1.R19(F:DGND54) IC1.R20(F:DGND55) IC1.T19(F:DGND56) IC1.T20(F:DGND57) IC1.U19(F:DGND58) IC1.V1(F:DGND59) IC1.V18(F:DGND60) IC1.V19(F:DGND61) IC1.W2(F:DGND62) IC1.W3(F:DGND63) IC1.W5(F:DGND65) IC1.W6(F:DGND66) IC1.W7(F:DGND67) IC1.W8(F:DGND68) IC1.W9(F:DGND69) IC1.W10(F:DGND70) IC1.W11(F:DGND71) IC1.W12(F:DGND72) IC1.W13(F:DGND73) IC1.W14(F:DGND74) IC1.W15(F:DGND75) IC1.W16(F:DGND76) IC1.W17(F:DGND77) IC1.W18(F:DGND78) IC1.W19(F:DGND79) IC1.W20(F:DGND80) IC1.Y7(F:DGND82) IC1.Y10(F:DGND83) IC1.Y12(F:DGND84) IC1.Y15(F:DGND85) IC1.Y18(F:DGND86) IC2.3(GND) IC3.3(GND) IC4.2(VSS) IC7.3(GND1) IC7.8(GND2) IC8.3(GND1) IC8.8(GND2) IC9.8(VPB[1]) IC9.9(VPB[0]) IC9.16(VPC[2]) IC9.17(VPC[1]) IC9.18(VPC[0]) IC9.19(VPP) IC9.53(A0_I2C) IC9.54(A1_I2C) IC9.61(VPA[2]) IC9.62(VPA[1]) IC9.63(VPA[0]) IC9.65(GND.PAD) IC10.11(GND) IC10.TP IC11.11(GND) IC11.TP IC12.1(GND) IC12.9(THERMAL) IC13.4(GND) IC14.4(GND) IC15.4(GND) IC17.1(1OE#) IC17.4(GND) IC18.3(GND1) IC18.6(GND2) IC19.2(GND) IC22.C4(VSSQ1) IC22.E7(VSS1) IC22.G5(VSS2) IC22.H10(VSS3) IC22.K8(VSS4) IC22.N2(VSSQ2) IC22.N5(VSSQ3) IC22.P4(VSSQ4) IC22.P6(VSSQ5) JTAG1.4(TDIS) JTAG1.8(GND1) JTAG1.10(GND2) JTAG1.12(GND3) JTAG1.16(GND4) JTAG1.20(GND5) MOD1.1(GND1) MOD1.7(GND2) MOD1.9(GND3) MOD1.15(GND4) MOD1.16(GND5) MOD1.17(GND6) MOD1.19(GND7) MOD1.20(GND8) MOD1.23(GND9) MOD1.24(GND10) MOD1.28(GND11) MOD1.29(GND12) MOD1.30(GND13) MOD1.31(GND14) MOD1.33(GND15) MOD1.34(GND16) MOD1.35(GND17) MOD1.37(GND18) MOD1.39(GND19) MOD1.44(GND20) MOD1.45(GND21) MOD1.48(GND22) MOD1.49(GND23) MOD1.54(GND24) MOD1.55(GND25) MOD1.59(GND26) MOD1.61(GND27) MOD1.63(GND28) MOD1.64(GND29) MOD1.G1 MOD1.G2 MOD1.G3 MOD1.G4 MOD1.G5 MOD1.G6 MOD1.G7 MOD1.G8 MOD1.G9 MOD1.G10 MOD1.G11 MOD1.G12 MOD1.G13 MOD1.G14 MOD1.G15 MOD1.G16 MOD1.G17 MOD1.G18 MOD1.G19 MOD1.G20 MOD1.G21 MOD1.G22 MOD1.G23 MOD1.G24 MOD1.G25 MOD1.G26 MOD1.G27 MOD1.G28 MOD1.G29 MOD1.G30 MOD1.G31 MOD1.G32 MOD1.G33 MOD1.G34 MOD1.G35 MOD1.G36 OSC1.2(GND) OSC2.2(GND) POWER.1 POWER.2 R10.2 R11.2 R17.1 R19.2 R22.2 R24.1 R27.2 R52.2 R55.1 R57.1 R61.1 R63.1 R65.1 R67.1 R69.1 R71.1 R73.1 R75.1 R85.1 R87.1 R94.2 R95.2 R106.2 R108.2 R109.2 R114.1 R119.2 R123.2 RESET.1 RESET.2 S2.3 S2.4 T3.S T4.S TP5.P$1(TP) USR0.K USR1.K USR2.K USR3.K X1.1 X2.6(VSS) X2.GND X3.4(GND) X4.GND X5.4(TMDS.DATA2.SHIELD) X5.7(TMDS.DATA1.SHIELD) X5.10(TMDS.DATA0.SHIELD) X5.13(TMDS.CLOCK.SHIELD) X5.16(DDC/CEC.GND) X8.1 X8.2 X9.1 X9.2 X9.43 X9.44 X9.45 X9.46 X12.OUT
GPIO0_7: R36.1 R38.1 X9.42
GPIO0_26: IC1.T11(A:GPIO0_26) X8.14
GPIO0_27: IC1.U12(A:GPIO0_27) X8.17
GPIO1_12: IC1.T12(A:GPIO1_12) X8.12
GPIO1_13: IC1.R12(A:GPIO1_13) X8.11
GPIO1_14: IC1.V13(A:GPIO1_14) X8.16
GPIO1_15: IC1.U13(A:GPIO1_15) X8.15
GPIO1_16: R54.1 X9.15
GPIO1_16.SIP: IC1.R13(A:GPIO1_16) R54.2
GPIO1_17: IC1.V14(A:GPIO1_17) X9.23
GPIO1_28: IC1.U18(A:GPIO1_28) X9.12
GPIO1_29: IC1.V6(A:GPIO1_29) X8.26
GPIO2_0.SIP: IC1.T13(A:GPIO2_0)
GPIO2_1: IC1.V12(A:GPIO2_1) X8.18
GPIO3_19: IC1.C13(B:GPIO3_19) X9.27
GPIO3_21: IC1.A14(B:GPIO3_21) R110.2 X9.25
HDMI.DSCL: IC9.33(DSCL) R115.2 X5.17(SCL)
HDMI.DSDA: IC9.32(DSDA) R118.2 X5.18(SDA)
HDMI_1V8: C50.1 C51.1 C52.1 C53.1 C54.1 C55.1 C56.1 C57.1 FB2.2 IC9.5(VDDDC1) IC9.14(VDDD1(IO)(1V8)) IC9.29(VDDDC2) IC9.35(VDDA(1V8)) IC9.36(VDDA1(TX)(1V8)) IC9.41(VDDA2(TX)(1V8)) IC9.46(VDDA3(TX)(1V8)) IC9.47(VDDA1(PLL)(1V8)) IC9.48(VDDA2(PLL)(1V8)) IC9.55(VDDD2(IO)(1V8))
HDMI_INT: IC1.U16(A:(HDMI_INT)GPIO1_25) IC9.50(INT) R121.2
HDMICLK_DIS#: IC1.V17(A:(HDMICLK_DISN)GPIO1_27) OSC1.1(INH#)
HPD: IC9.31(HPD) X5.1(HOT.PLUG.DETECT)
I2C0_SCL: IC1.C16(C:I2C0_SCL) IC1.C20(C:PMIC_I2C_SCL) IC4.1(SCL) IC9.52(CSCL) R41.2
I2C0_SDA: IC1.C17(C:I2C0_SDA) IC1.C19(C:PMIC_I2C_SDA) IC4.3(SDA) IC9.51(CSDA) R42.2
I2C1_SCL: IC1.A16(B:I2C1_SCL) X9.17
I2C1_SDA: IC1.B16(B:I2C1_SDA) X9.18
I2C2_SCL: IC1.D17(B:I2C2_SCL) X9.19
I2C2_SDA: IC1.D18(B:I2C2_SDA) X9.20
JTAG_EMU0: IC1.C14(A:JTAG_EMU0) JTAG1.13(EMU0) R43.2
JTAG_EMU1: IC1.B14(A:JTAG_EMU1) JTAG1.14(EMU1) R53.2
JTAG_TCK: IC1.A12(A:JTAG_TCK) JTAG1.9(TCKRTN) JTAG1.11(TCK)
JTAG_TDI: IC1.B11(A:JTAG_TDI) JTAG1.3(TDI)
JTAG_TDO: IC1.A11(A:JTAG_TDO) JTAG1.7(TDO)
JTAG_TMS: IC1.C11(A:JTAG_TMS) JTAG1.1(TMS)
JTAG_TRSTN: IC1.B10(A:JTAG_TRSTN) JTAG1.2(TRST#) R52.1
LCD.CLOCK: IC9.4(PCLK) R34.1 X8.28
LCD.D0.B0--B3: C42.1 IC1.R1(B:LCD_DATA0) IC9.15(VPC[3]) R87.2 X8.45
LCD.D1.B1--B4: C41.1 IC1.R2(B:LCD_DATA1) IC9.13(VPC[4]) R85.2 X8.46
LCD.D2.B2--B5: C40.1 IC1.R3(B:LCD_DATA2) IC9.12(VPC[5]) R82.1 R88.1 X8.43
LCD.D3.B3--B6: C39.1 IC1.R4(B:LCD_DATA3) IC9.11(VPC[6]) R80.1 X8.44
LCD.D4.B4--B7: C38.1 IC1.T1(B:LCD_DATA4) IC9.10(VPC[7]) R78.1 X8.41
LCD.D5.G0--G2: C37.1 IC1.T2(B:LCD_DATA5) IC9.7(VPB[2]) R76.1 X8.42
LCD.D6.G1--G3: C36.1 IC1.T3(B:LCD_DATA6) IC9.6(VPB[3]) R75.2 X8.39
LCD.D7.G2--G4: C35.1 IC1.T4(B:LCD_DATA7) IC9.3(VPB[4]) R73.2 X8.40
LCD.D8.G3--G5: C34.1 IC1.U1(B:LCD_DATA8) IC9.2(VPB[5]) R71.2 X8.37
LCD.D9.G4--G6: C33.1 IC1.U2(B:LCD_DATA9) IC9.1(VPB[6]) R69.2 X8.38
LCD.D10.G5--G7: C32.1 IC1.U3(B:LCD_DATA10) IC9.64(VPB[7]) R67.2 X8.36
LCD.D11.R0--R3: C31.1 IC1.U4(B:LCD_DATA11) IC9.60(VPA[3]) R65.2 X8.34
LCD.D12.R1--R4: C30.1 IC1.V2(B:LCD_DATA12) IC9.59(VPA[4]) R63.2 X8.35
LCD.D13.R2--R5: C29.1 IC1.V3(B:LCD_DATA13) IC9.58(VPA[5]) R61.2 X8.33
LCD.D14.R3--R6: C28.1 IC1.V4(B:LCD_DATA14) IC9.57(VPA[6]) R58.1 X8.31
LCD.D15.R4--R7: C27.1 IC1.T5(B:LCD_DATA15) IC9.56(VPA[7]) R57.2 X8.32
LCD.ENABLE: IC9.20(DE/FREF) R39.1 X8.30
LCD.HSYNC: IC9.22(HSYNC/HREF) R37.1 X8.29
LCD.VSYNC: IC9.21(VSYNC/VREF) R35.1 X8.27
LDO_PGOOD: IC1.B5(A:RTC_PORZ) IC1.B20(C:PMIC_LDO_PGOOD)
LS_BUF_OE: IC1.L18(B:MII_RXCLK) R131.2
MCC1_CLK: IC1.U9(A:MMC1_CLK) IC22.M6(CLK) R31.1 X8.21
MCC1_CMD: IC1.V9(A:MMC1_CMD) IC22.M5(CMD) R30.1 X8.20
MCC1_DAT0: IC1.U7(A:MMC1_DAT0) IC22.A3(DAT0) R12.1 X8.25
MCC1_DAT1: IC1.V7(A:MMC1_DAT1) IC22.A4(DAT1) R13.1 X8.24
MCC1_DAT2: IC1.R8(A:MMC1_DAT2) IC22.A5(DAT2) R16.1 X8.5
MCC1_DAT3: IC1.T8(A:MMC1_DAT3) IC22.B2(DAT3) R18.1 X8.6
MCC1_DAT4: IC1.U8(A:MMC1_DAT4) IC22.B3(DAT4) R20.1 X8.23
MCC1_DAT5: IC1.V8(A:MMC1_DAT5) IC22.B4(DAT5) R23.1 X8.22
MCC1_DAT6: IC1.R9(A:MMC1_DAT6) IC22.B5(DAT6) R25.1 X8.3
MCC1_DAT7: IC1.T9(A:MMC1_DAT7) IC22.B6(DAT7) R28.1 X8.4
MCU.LCD.CLK: IC1.V5(B:LCD_PCLK) R34.2
MCU.LCD.EN: IC1.R6(B:LCD_DE) R39.2
MCU.LCD.HS: IC1.R5(B:LCD_HSYNC) R37.2
MCU.LCD.VS: IC1.U5(B:LCD_VSYNC) R35.2
N$1: OSC2.1(EN) R90.2
N$2: R88.2 S2.1 S2.2
N$3: IC1.A15(A:CLKOUT1) R9.1
N$4: PWR.K R55.2
N$5: IC18.1(SHDN#) R89.2 R97.2
N$6: C4.1 IC1.K20(A:OSC0_OUT) Q4.1 R8.1
N$7: C3.1 IC1.M20(A:OSC0_IN) Q4.2 R8.2
N$8: IC1.C6(C:PMIC_POWER_EN) IC1.D19(C:PWR_EN)
N$9: IC18.5(ADJ) R93.2 R94.1
N$11 [power]: C3.2 C4.2 IC1.L20(A:DGND0)
N$12: C5.2 C6.2 IC1.G20(A:DGND1)
N$13: ANT2.SIG C60.1
N$14: ANT1.SIG C46.1
N$15: C46.2 MOD1.32(RF_ANT1)
N$16: R100.1 USR1.A
N$17: R96.1 USR2.A
N$18: R92.1 USR3.A
N$19: C60.2 MOD1.18(RF_ANT2)
N$20: IC1.P17(B:USB1_ID) R27.1
N$22: IC1.B4(E:RTC_KALDO_ENN) R24.2
N$24: T3.D WL.K
N$28: IC1.D13(A:GPIO3_20) R14.2
N$29: IC1.D14(A:CLKOUT2) R15.2
N$30: IC1.R14(A:(EMMC_RSTN)GPIO1_20) IC3.2(A)
N$31: IC3.4(Y) R29.2
N$33: MOD1.26(GPIO2) TP12.TP
N$34: R104.1 USR0.A
N$35: MOD1.27(GPIO1) TP13.TP
N$36: C5.1 IC1.H20(A:OSC1_IN) Q2.P$1 R56.2
N$37: C6.1 IC1.F20(A:OSC1_OUT) Q2.P$2 R56.1
N$38: MOD1.42(WL_UART_DBG) TP14.TP
N$39: MOD1.43(BT_UART_DBG) TP15.TP
N$40: MOD1.56(BT_AUD_IN) TP16.TP
N$41: MOD1.57(BT_AUD_OUT) TP17.TP
N$42: OSC1.3(OUT) R110.1
N$43: MOD1.58(BT_AUD_FSYNC) TP18.TP
N$44: MOD1.60(BT_AUD_CLK) TP19.TP
N$45: IC1.P15(B:USB0_VBUS) R26.1
N$47: C7.1 C69.1 IC22.C2(VDDI)
N$48: IC1.C18(B:GPIO0_7) R36.2
N$49: IC1.B12(B:GPIO3_18) R38.2
N$50: IC5.2(C) R44.2 R45.1 T1.B
N$51: IC5.1(FB) R45.2 R46.2 R47.1
N$52: IC6.2(C) R48.2 R49.1 T2.B
N$53: IC6.1(FB) R49.2 R50.2 R51.1
N$54: IC4.5(WP) R40.2 TP1.P$1(TP)
N$56: BT.K T4.D
N$57: R125.1 WL.A
N$58: IC13.5(Q) R113.1
N$59: BT.A R124.1
N$62: MOD1.14(WLAN_IRQ) R60.1 R111.2
N$63: MOD1.13(WL_SDIO_D3) R72.1
N$64: MOD1.12(WL_SDIO_D2) R70.1
N$65: MOD1.11(WL_SDIO_D1) R68.1
N$66: D1.A(ANODE) R120.2
N$67: MOD1.10(WL_SDIO_D0) R66.1
N$69: MOD1.8(WL_SDIO_CLK) R64.1
N$70: MOD1.6(WL_SDIO_CMD) R62.1
N$93: MOD1.50(BT_HCI_RTS) R140.1
N$94: MOD1.51(BT_HCI_CTS) R141.1
N$95: MOD1.52(BT_HCI_TX) R142.1
N$96: MOD1.53(BT_HCI_RX) R143.1
NC1: IC1.K16(B:MII1_TXD1)
NC2: IC1.H17(B:MII1_CRS_DV)
NC3: IC1.M16(B:MII1_RXD0)
NC4: IC1.J15(B:MII1_RXERR)
PMIC_INT: IC1.B18(A:EXTIN) IC1.B19(C:PMIC_INTN)
PMIC_NWAKEUP: IC1.A19(C:PMIC_WAKEUPN) IC1.C5(A:EXT_WAKEUP)
PMIC_PGOOD: IC1.A20(C:PMIC_PGOOD) IC1.B15(A:PORZ) IC2.2(A)
PWR_BUT: IC1.D20(C:PWR_BUT) POWER.3 POWER.4 X9.9
RX<-TX: IC17.3(2Y) X1.5
SD.CD: IC1.C15(A:MMC0_CD) JTAG1.19(EMU4) R7.1 X2.CD(CD#)
SD.CLK: IC1.G17(A:MMC0_CLK0) R3.1 X2.5(CLK)
SD.CMD: IC1.G18(A:MMC0_CMD) R4.1 X2.3(CMD/DI)
SD.D0: IC1.G16(A:MMC0_DAT0) R2.1 X2.7(DAT0/DO)
SD.D1: IC1.G15(A:MMC0_DAT1) R1.1 X2.8(DAT1)
SD.D2: IC1.F18(A:MMC0_DAT2) R6.1 X2.1(DAT2)
SD.D3: IC1.F17(A:MMC0_DAT3) R5.1 X2.2(DAT3/CS)
SELECT_5V: D2.K D3.K D4.K FB1.1 R97.1 TP23.TP
SLOW_CLK: IC11.5(A4) R91.1
SPI1_CS0: IC1.C12(B:SPI1_CS0) IC9.25(AP1) X9.28
SPI1_D0: IC1.B13(B:SPI1_D0) IC9.24(AP0) X9.29
SPI1_D1: IC1.D12(B:SPI1_D1) X9.30
SPI1_SCLK: IC1.A13(B:SPI1_CLK) IC9.23(ACLK) X9.31
SYS_5V: C62.+ D2.A F1.2 IC1.W4(C:SYS_5V_1) IC1.Y4(C:SYS_5V_2) IC12.2(IN1) IC12.3(IN2) X9.7 X9.8
SYS_RESET#: C16.1 C21.1 IC1.A10(A:SYS_RESETN) IC2.4(Y) JTAG1.15(SRST) R32.2 RESET.3 RESET.4 X9.10
TEST: IC9.49(TEST) R114.2
TIMER4: IC1.R7(A:TIMER4) X8.7
TIMER5: IC1.T6(A:TIMER5) X8.9
TIMER6: IC1.U6(A:TIMER6) X8.10
TIMER7: IC1.T7(A:TIMER7) X8.8
TX0+: IC8.5(TMDS.CH2+) IC9.40(TX0+) X5.9(TMDS.DATA0+)
TX0-: IC8.4(TMDS.CH2-) IC9.39(TX0-) X5.11(TMDS.DATA0-)
TX1+: IC7.2(TMDS.CH1+) IC9.43(TX1+) X5.6(TMDS.DATA1+)
TX1-: IC7.1(TMDS.CH1-) IC9.42(TX1-) X5.8(TMDS.DATA1-)
TX2+: IC7.5(TMDS.CH2+) IC9.45(TX2+) X5.3(TMDS.DATA2+)
TX2-: IC7.4(TMDS.CH2-) IC9.44(TX2-) X5.5(TMDS.DATA2-)
TX->RX: IC17.2(1A) R123.1 X1.4
TXC+: IC8.2(TMDS.CH1+) IC9.38(TXC+) X5.12(TMDS.CLOCK+)
TXC-: IC8.1(TMDS.CH1-) IC9.37(TXC-) X5.14(TMDS.CLOCK-)
UART0_RST#: IC1.E17(B:UART0_RSTN) TP6.TP
UART0_RXD: IC1.E15(B:UART0_RXD) IC17.6(1Y)
UART0_TXD: IC1.E16(B:UART0_TXD) IC17.5(2A)
UART1_RXD: IC1.D16(B:UART1_RXD) X9.26
UART1_TXD: IC1.D15(B:UART1_TXD) X9.24
UART2_RXD: IC1.A17(B:UART2_RXD) X9.22
UART2_TXD: IC1.B17(B:UART2_TXD) X9.21
UART4_RXD: IC1.T17(A:UART4_RXD) X9.11
UART4_TXD: IC1.U17(A:UART4_TXD) X9.13
USB1_DRVVBUS: IC1.F15(B:USB1_DRVVBUS) IC12.4(EN#) R19.1
USB1_OC#: IC1.T16(A:(USB1_OCN)GPIO1_26) IC12.5(OC#) R122.2
USB1_VBUS: FB4.2 IC1.T18(B:USB1_VBUS)
USB.CLIENT.D+: IC1.N17(B:USB0_DP) IC14.1(D+) X4.D+
USB.CLIENT.D-: IC1.N18(B:USB0_DM) IC14.2(D-) X4.D-
USB.CLIENT.ID: IC1.P16(B:USB0_ID) IC14.3(ID) X4.ID
USB.HOST.D+: IC1.R17(B:USB1_DP) IC15.1(D+) X3.3(D+)
USB.HOST.D-: IC1.R18(B:USB1_DM) IC15.2(D-) X3.2(D-)
USB_DC: C59.1 D4.A IC1.Y8(C:VIN_USB_0) IC1.Y9(C:VIN_USB_1) IC14.6(VBUS) R26.2 X4.VBUS
USR0: IC1.V15(A:USR0) R104.2
USR1: IC1.U15(A:USR1) R100.2
USR2: IC1.T15(A:USR2) R96.2
USR3: IC1.V16(A:USR3) R92.2
VBUS.HOST: FB3.2 X3.1(VBUS)
VBUS.OUT: C58.1 FB3.1 FB4.1 IC12.6(OUT1) IC12.7(OUT2) IC12.8(OUT3) IC15.6(VBUS)
VDD_1V8: FB2.1 IC1.D10(E:VDD_1V84) IC1.E9(E:VDD_1V83) IC1.N16(C:VDD_1V8_0) IC1.R16(C:VDD_1V8_1) IC2.5(VCC) IC5.3(A) IC6.3(A) R47.2 R51.2 T1.C T2.C
VDD_3V3A: IC1.N5(E:VDD_3V3A18) IC1.P5(E:VDD_3V3A17) IC1.P6(E:VDD_3V3A16) IC1.P7(E:VDD_3V3A15) R44.1 R46.1 T1.E
VDD_3V3AUX: IC1.Y11(C:VDD_3V3AUX) PWR.A
VDD_3V3B: C1.1 C2.1 C9.1 C12.1 C13.1 C14.1 C15.1 C17.1 C18.1 C22.1 C47.1 C48.1 C49.1 IC1.U20(C:VDD_3V3B_0) IC1.V20(C:VDD_3V3B_1) IC3.5(VCC) IC4.4(VCC) IC13.6(CLR#) IC13.7(PRE#) IC13.8(VCC) IC17.7(2OE) IC17.8(VCC) IC22.C6(VCCQ1) IC22.E6(VCC1) IC22.F5(VCC2) IC22.J10(VCC3) IC22.K9(VCC4) IC22.M4(VCCQ2) IC22.N4(VCCQ3) IC22.P3(VCCQ4) IC22.P5(VCCQ5) JTAG1.5(TVDD) OSC1.4(VCC) R1.2 R2.2 R3.2 R4.2 R5.2 R6.2 R7.2 R12.2 R13.2 R16.2 R18.2 R20.2 R21.1 R23.2 R25.2 R28.2 R30.2 R31.2 R32.1 R33.2 R40.1 R41.1 R42.1 R43.1 R48.1 R50.1 R53.1 R58.2 R76.2 R78.2 R80.2 R82.2 R89.1 R120.1 R121.1 R122.1 T2.E X2.4(VDD) X9.3 X9.4
VDD_5V: D3.A IC1.Y5(C:VIN_5V_0) IC1.Y6(C:VIN_5V_1) X9.5 X9.6 X12.IN
VDD_ADC: IC1.A4(B:VDD_ADC_1) IC1.A5(B:VDD_ADC_0) IC1.B9(B:VREFP_ADC) IC1.D8(E:VDDA_ADC) X9.32
VDD_CORE: IC1.F6(E:VDD_CORE1)
VDD_MPU: IC1.F10(E:VDD_MPU0)
VDD_RTC: IC1.N6(E:VDD_RTC4)
VDDS_DDR: IC1.H5(E:VDDS_DDR4)
VDDS_PLL: IC1.E7(E:VDD_PLL1)
VIN_BAT: IC1.Y2(C:BAT_1) IC1.Y3(C:BAT_2) TP2.P$1(TP)
WL_EN: IC11.3(A2) MOD1.40(WLAN_EN) R10.1 T3.G
WL_EN.SIP: IC1.K18(B:MII1_TXCLK) R136.1
WL_IRQ: IC11.9(A8) R60.2
WL_IRQ.SIP: IC1.H18(B:MII1_REFCLK) R134.1
WL_SDIO_CLK: IC10.6(A5) R64.2 R103.2
WL_SDIO_CLK.SIP: IC1.L15(B:MII1_RXD1) R126.1
WL_SDIO_CMD: IC10.7(A6) R62.2 R105.2
WL_SDIO_CMD.SIP: IC1.J16(B:MII1_TXEN) R86.1
WL_SDIO_D0: IC10.1(A1) R66.2 R98.2
WL_SDIO_D0.SIP: IC1.J17(B:MII1_RXDV) R130.1
WL_SDIO_D1: IC10.3(A2) R68.2 R99.2
WL_SDIO_D1.SIP: IC1.J18(B:MII1_TXD3) R129.1
WL_SDIO_D2: IC10.4(A3) R70.2 R101.2
WL_SDIO_D2.SIP: IC1.K15(B:MII1_TXD2) R128.1
WL_SDIO_D3: IC10.5(A4) R72.2 R102.2
WL_SDIO_D3.SIP: IC1.H16(B:MII1_COL) R127.1
XDMA_EVENT_INTRO: IC13.1(CLK) JTAG1.17(EMU2) R9.2
Unconnected: D8.1(A1) FUD1.P$1 FUD2.P$1 FUD3.P$1 FUD4.P$1 FUD5.P$1 FUD6.P$1 IC1.A2(E:VDD_MPU_MON) IC1.A3(E:TESTOUT) IC1.B1(D:NC1) IC1.B2(D:NC2) IC1.B3(D:NC3) IC1.C1(D:NC4) IC1.C2(D:NC5) IC1.C3(D:NC6) IC1.C4(D:NC12) IC1.C10(E:CAP_VBB_MPU) IC1.D1(D:NC20) IC1.D2(D:NC21) IC1.D3(D:NC22) IC1.D4(D:NC23) IC1.D5(D:NC24) IC1.D6(E:CAP_VDD_RTC) IC1.D7(E:VDD_RTC1) IC1.D9(E:CAP_VDD_SRAM_COR) IC1.D11(E:CAP_VDD_SRAM_MPU) IC1.E1(D:NC31) IC1.E2(D:NC32) IC1.E3(D:NC33) IC1.E4(D:NC34) IC1.E5(E:VDDS_DDR1) IC1.E6(E:VDD_RTC2) IC1.E10(E:VDD_3V3A22) IC1.E11(E:VDD_3V3A21) IC1.E12(E:VDD_3V3A20) IC1.E13(E:VDD_3V3A19) IC1.E14(E:VDD_RTC7) IC1.E18(B:UART0_CTSN) IC1.F1(D:NC45) IC1.F2(D:NC46) IC1.F3(D:NC47) IC1.F4(D:NC48) IC1.F5(E:VDDS_DDR2) IC1.F7(E:VDD_CORE2) IC1.F9(E:VDD_RTC3) IC1.F11(E:VDD_MPU1) IC1.F12(E:VDD_MPU2) IC1.F13(E:VDD_MPU3) IC1.F14(E:VDD_3V3A1) IC1.F16(B:USB0_DRVVBUS) IC1.G1(D:NC58) IC1.G2(D:NC59) IC1.G3(D:NC60) IC1.G4(D:NC61) IC1.G5(E:VDDS_DDR3) IC1.G6(E:VDD_CORE3) IC1.G7(E:VDD_CORE4) IC1.G10(E:VDD_CORE5) IC1.G13(E:VDD_MPU4) IC1.G14(E:VDD_3V3A2) IC1.H1(D:NC68) IC1.H2(D:NC69) IC1.H3(D:NC70) IC1.H4(D:NC71) IC1.H11(E:VDD_CORE6) IC1.H13(E:VDD_MPU5) IC1.H14(E:VDD_3V3A3) IC1.H15(E:VDD_PLL4) IC1.J1(D:NC76) IC1.J2(D:NC77) IC1.J3(D:NC78) IC1.J4(D:NC79) IC1.J5(E:VDDS_DDR5) IC1.J12(E:VDD_CORE7) IC1.J13(E:VDD_MPU6) IC1.J14(E:VDD_3V3A4) IC1.K1(D:NC84) IC1.K2(D:NC85) IC1.K3(D:NC86) IC1.K4(D:NC87) IC1.K5(E:VDDS_DDR6) IC1.K6(E:VDD_CORE8) IC1.K8(E:VDD_CORE9) IC1.K12(E:VDD_CORE10) IC1.K13(E:VDD_RTC6) IC1.K14(E:VDD_3V3A5) IC1.L1(D:NC94) IC1.L2(D:NC95) IC1.L3(D:NC96) IC1.L4(D:NC97) IC1.L5(E:VDDS_DDR7) IC1.L6(E:VDD_CORE11) IC1.L7(E:VDD_CORE12) IC1.L8(E:VDD_CORE13) IC1.L9(E:VDD_CORE14) IC1.L14(E:VDD_3V3A6) IC1.M1(D:NC104) IC1.M2(D:NC105) IC1.M3(D:NC106) IC1.M4(D:NC107) IC1.M5(E:VPP) IC1.M11(E:VDD_CORE15) IC1.M13(E:VDD_CORE16) IC1.M15(B:USB0_CE) IC1.N1(D:NC111) IC1.N2(D:NC112) IC1.N3(D:NC113) IC1.N4(D:NC114) IC1.N8(E:VDD_CORE17) IC1.N9(E:VDD_CORE18) IC1.N12(E:VDD_CORE19) IC1.N13(E:VDD_CORE20) IC1.N15(E:VDD_3V3A7) IC1.P1(D:NC121) IC1.P2(D:NC122) IC1.P3(D:NC123) IC1.P4(D:NC124) IC1.P8(E:VDD_3V3A14) IC1.P9(E:VDD_RTC8) IC1.P10(E:VDD_3V3A12) IC1.P11(E:VDD_3V3A11) IC1.P12(E:VDD_3V3A10) IC1.P13(E:VDD_3V3A9) IC1.P14(E:VDD_RTC5) IC1.P18(B:USB1_CE) IC1.R10(E:VDD_PLL2) IC1.R11(E:VDD_PLL3) IC1.R15(E:VDD_3V3A8) IC1.U11(D:NC136) IC1.V10(D:NC137) IC1.V11(D:NC138) IC1.Y13(C:VDDS_DDR) IC1.Y14(C:L1_IN) IC1.Y16(C:VDD_MPU) IC1.Y17(C:L2_IN) IC1.Y19(C:VDD_CORE) IC1.Y20(C:L3_IN) IC7.6(NC1) IC7.7(NC2) IC7.9(NC3) IC7.10(NC4) IC8.6(NC1) IC8.7(NC2) IC8.9(NC3) IC8.10(NC4) IC9.26(AP2) IC9.28(AP4) IC10.8(A7) IC10.9(A8) IC10.12(B8) IC10.13(B7) IC14.5(NC) IC15.3(ID) IC15.5(NC) IC19.4(NC/ADJ) JTAG1.6(NC) MOD1.2(GPIO11) MOD1.3(GPIO9) MOD1.4(GPIO10) MOD1.5(GPIO12) MOD1.21(RESERVED1) MOD1.22(RESERVED2) MOD1.25(GPIO4) MOD1.62(RESERVED3) X1.2 X1.3 X1.6 X5.2(NC) X12.OUT_CON

## Notes on the sheet
- SEE NOTES IN GREEN
- eMMC 4GB
- USB Host | USB Device
- Used a tantalum cap instead
  of the large aluminum cap
- OSD3358 SiP
- Power
- RESET#
- JTAG
- WiFi Module
- 1.8V WiFi Power Regulator
- BeagleBone Black
  Configuration
- uSD BOOT
- <-- SYS_BOOT0
  <-- SYS_BOOT1
  <-- SYS_BOOT2
  <-- SYS_BOOT3
  <-- SYS_BOOT4
  <-- SYS_BOOT5
  <-- SYS_BOOT6
  <-- SYS_BOOT7
  <-- SYS_BOOT8
  <-- SYS_BOOT9
  <-- SYS_BOOT10
  <-- SYS_BOOT11
  <-- SYS_BOOT12
  <-- SYS_BOOT13
  <-- SYS_BOOT14
  <-- SYS_BOOT15
- HDMI Interface | uSD Connector
- We are using fuse instead of the PCE power Trip
- EEPROM | USER LEDs
- BeagleBone Black Headers
- Did not include the transistor array
- Prototyped by: GHI Electronics, LLC
- GHI-PROTO-BBBW-REV-A3
- A3

## Library data of the parts
ANT1 ANT2 = GHI-Connectors:U.FL-R-SMT-1
BT PWR USR0 USR1-USR3 WL = GHI-BasicComponents:LED-(INCH)-
C1-C10 C12-C22 C24 C25 C27-C61 C63 C64 C69 = rcl:C-US: CAPACITOR, American symbol
C11 C23 C62 = rcl:CPOL-US: POLARIZED CAPACITOR, American symbol
D1 = GHI-BasicComponents:DIODE-SCHOTTKY-(NXP)-
D2-D4 = GHI:DIODE_SMA
D8 = diode:BAT54C: Schottky Diodes Source: Fairchild .. BAT54.pdf
F1 = inductor-neosid:SM-1206: INDUCTOR SMD chip inductor
FB1-FB4 = GHI-BasicComponents:FB-(INCH)-
FUD1-FUD6 = GHI:FIDUCIAL
IC1 = GHI-SoMs-Processors:SIP1000
IC2 = GHI-IC:SN74LVC1G07DCK
IC3 = GHI-IC:SN74LVC1G06DCK
IC4 = GHI-IC:24LC32A: 32K i2c Serial EEPROM
IC5 IC6 = texas:LM4041*I: PRECISION MICROPOWER SHUNT VOLTAGE REFERENCE Adjustable Output Source: http://focus.ti.com/lit/ds/slcs146e/slcs146e.pdf; MF: TEXAS INSTRUMENT CONNECTORS; MPN: LM4041DIDBZR; OC_FARNELL: 1053788; OC_NEWARK: 31K7146
IC7 IC8 = GHI-IC:IP4283CZ10: ESD protection for ultra high-speed interfaces
IC9 = GHI-IC:TDA19988BHN/C1
IC10 IC11 = GHI-IC:TXS0108ERGYR
IC12 = GHI-IC:TPS2051B
IC13 = GHI-IC:SN74AUC1G74
IC14 IC15 = GHI-IC:TPD4S012DRYR
IC17 = GHI-IC:SN74LVC2G241DCUR
IC18 = GHI-IC:TL1963A
IC19 = GHI:5PIN_REG
IC22 = GHI-IC:EMMC04G-S100-B08U
JTAG1 = BeagleBoneBlack:JTAG
MGT1-MGT4 = BeagleBoneBlack:MOUNTING_HOLE: Chassis Mounting Hole w/GND connection ability
MOD1 = GHI-IC:WL1835MOD
OSC1 = GHI2:OSC-2.5X2.0
OSC2 = GHI-IC:OSCILLATOR
POWER RESET S2 = GHI2:MINI_PUSHBUTTON
Q2 = GHI2:CRYSTAL_3.2X1.5
Q4 = GHI2:CRYSTAL_5X3.2MM
R1-R58 R60-R73 R75 R76 R78 R80 R82 R85-R106 R108-R111 R113-R115 R118-R131 R134-R136 R140-R143 = rcl:R-US_: RESISTOR, American symbol
T1 T2 = transistor-pnp:MMBT2907*: PNP Transistror
T3 T4 = GHI Transistors:BSS138W-7-F
TP1-TP5 = GHI2:TESTPAD/W_HOLE_1X1
TP6 TP12-TP19 TP23 = testpad:PTR1: TEST PIN
X1 = GHI-Headers:1X6-(INCH)-0.1-
X2 = GHI-Connectors:SCHA5B0200(ALPS_USD)
X3 = GHI2:USB_HOST_W/CHASSIS_GND
X4 = GHI-Connectors:10118192-0001LF: Amphenol FCI Micro USB Type B Complete Surface Mount (SMT) no guide holes
X5 = GHI-Connectors:HDMI-TYPE-D-10118241
X8 X9 = GHI-Headers:HEADER-2X23-(INCH)-0.1-
X12 = GHI:PJ-102B_POWER_CON